# EAGLE board (Eagle)PowerUnit-Bseries(ver2.0) (EAGLE 9.6.2), part 1 of 2
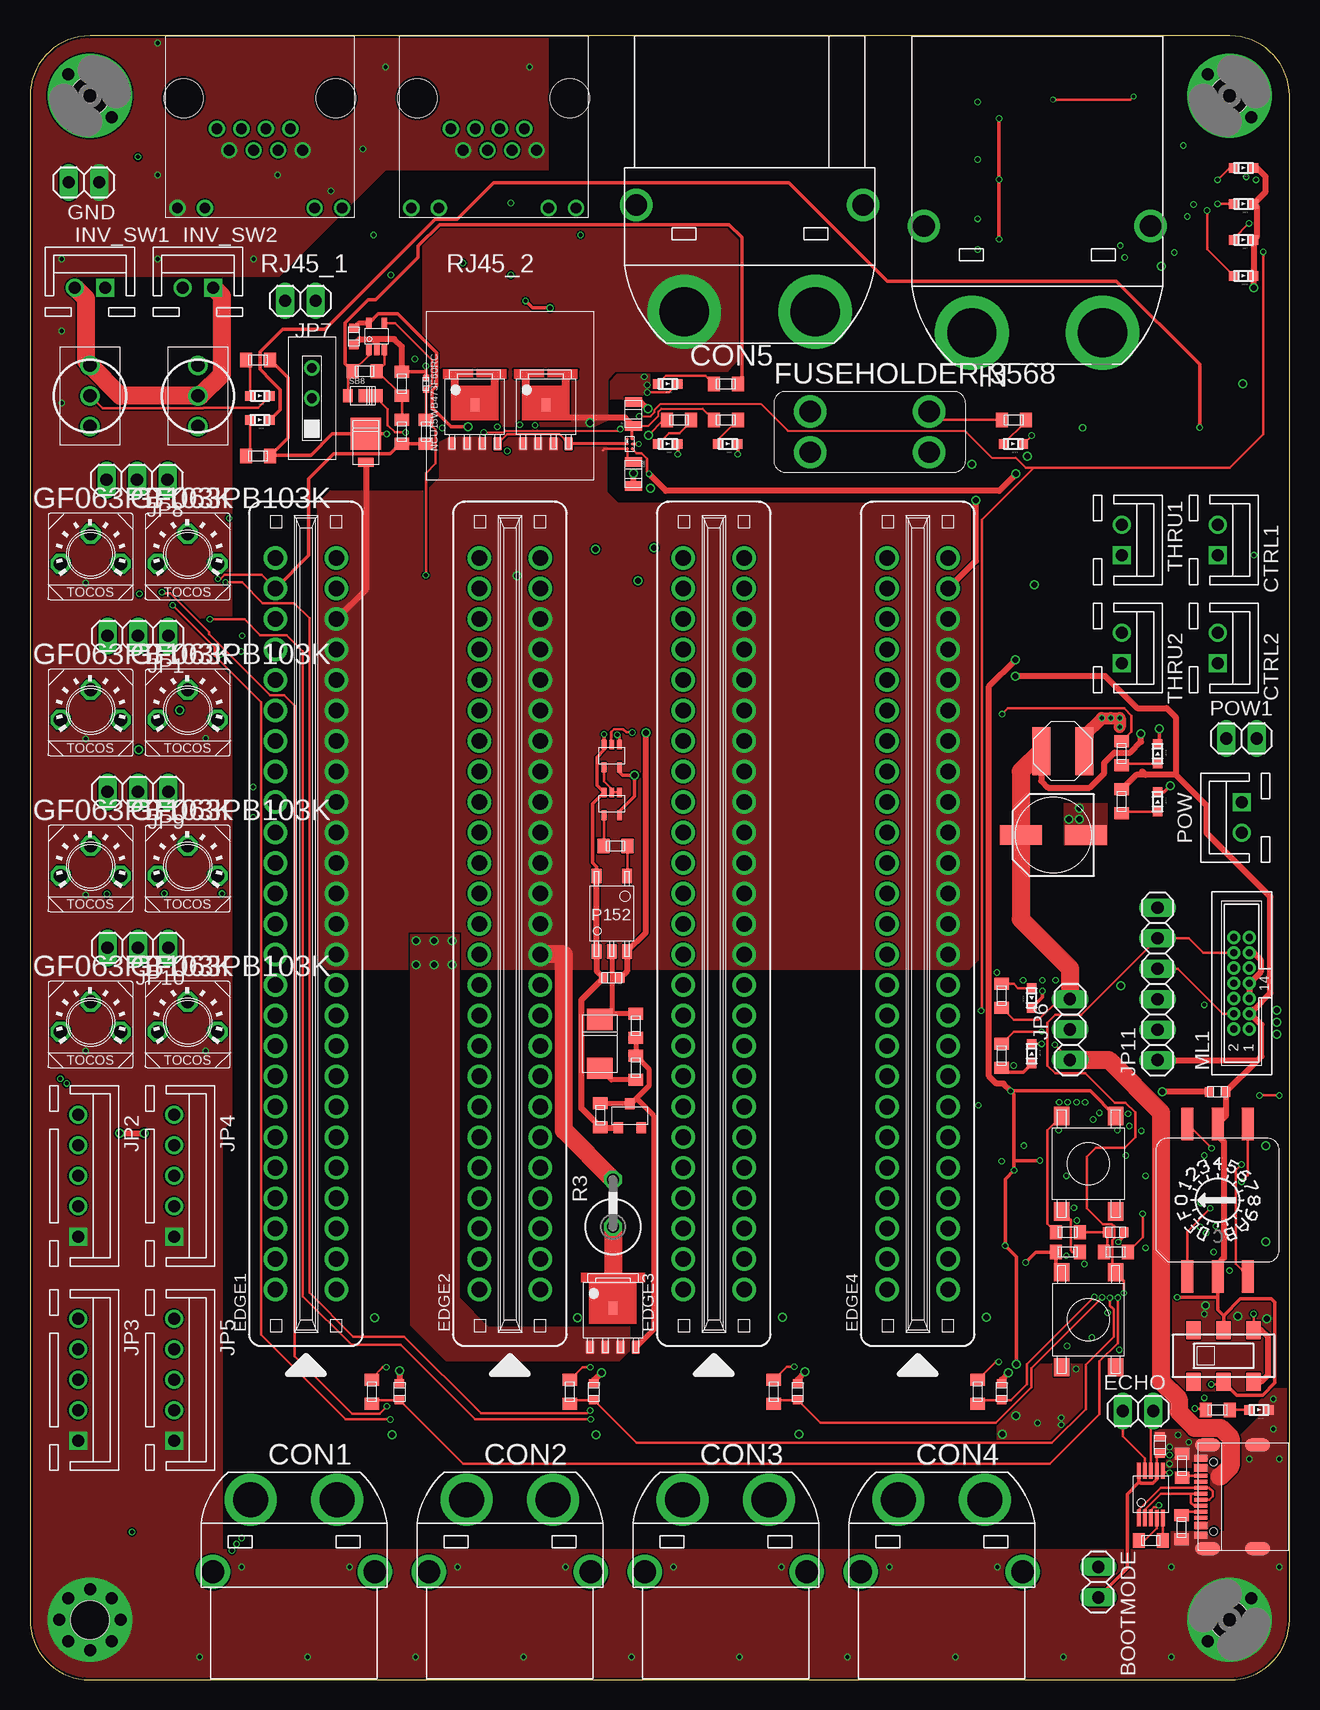
[diagram p4: board, top side]
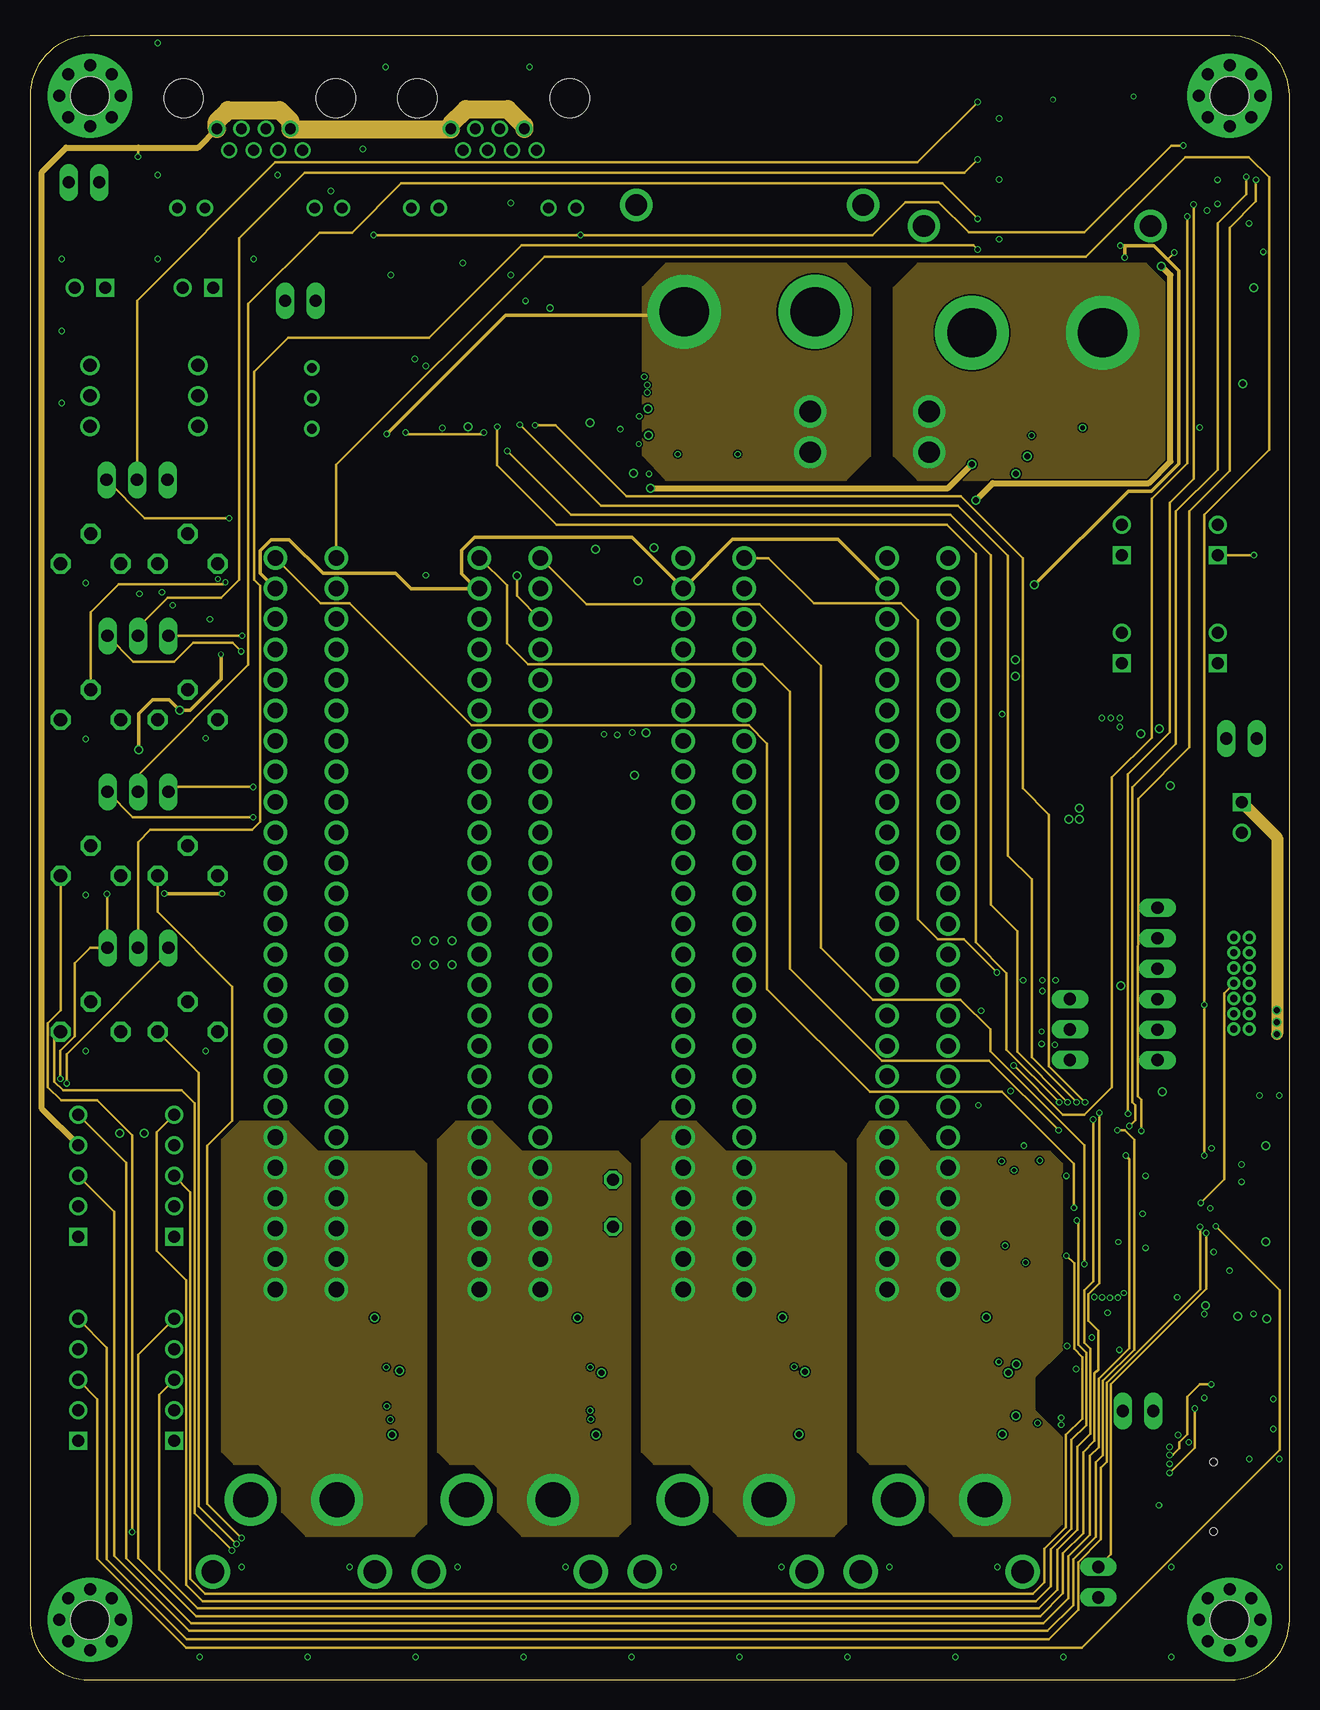
[diagram p5: board, inner layer Route2]
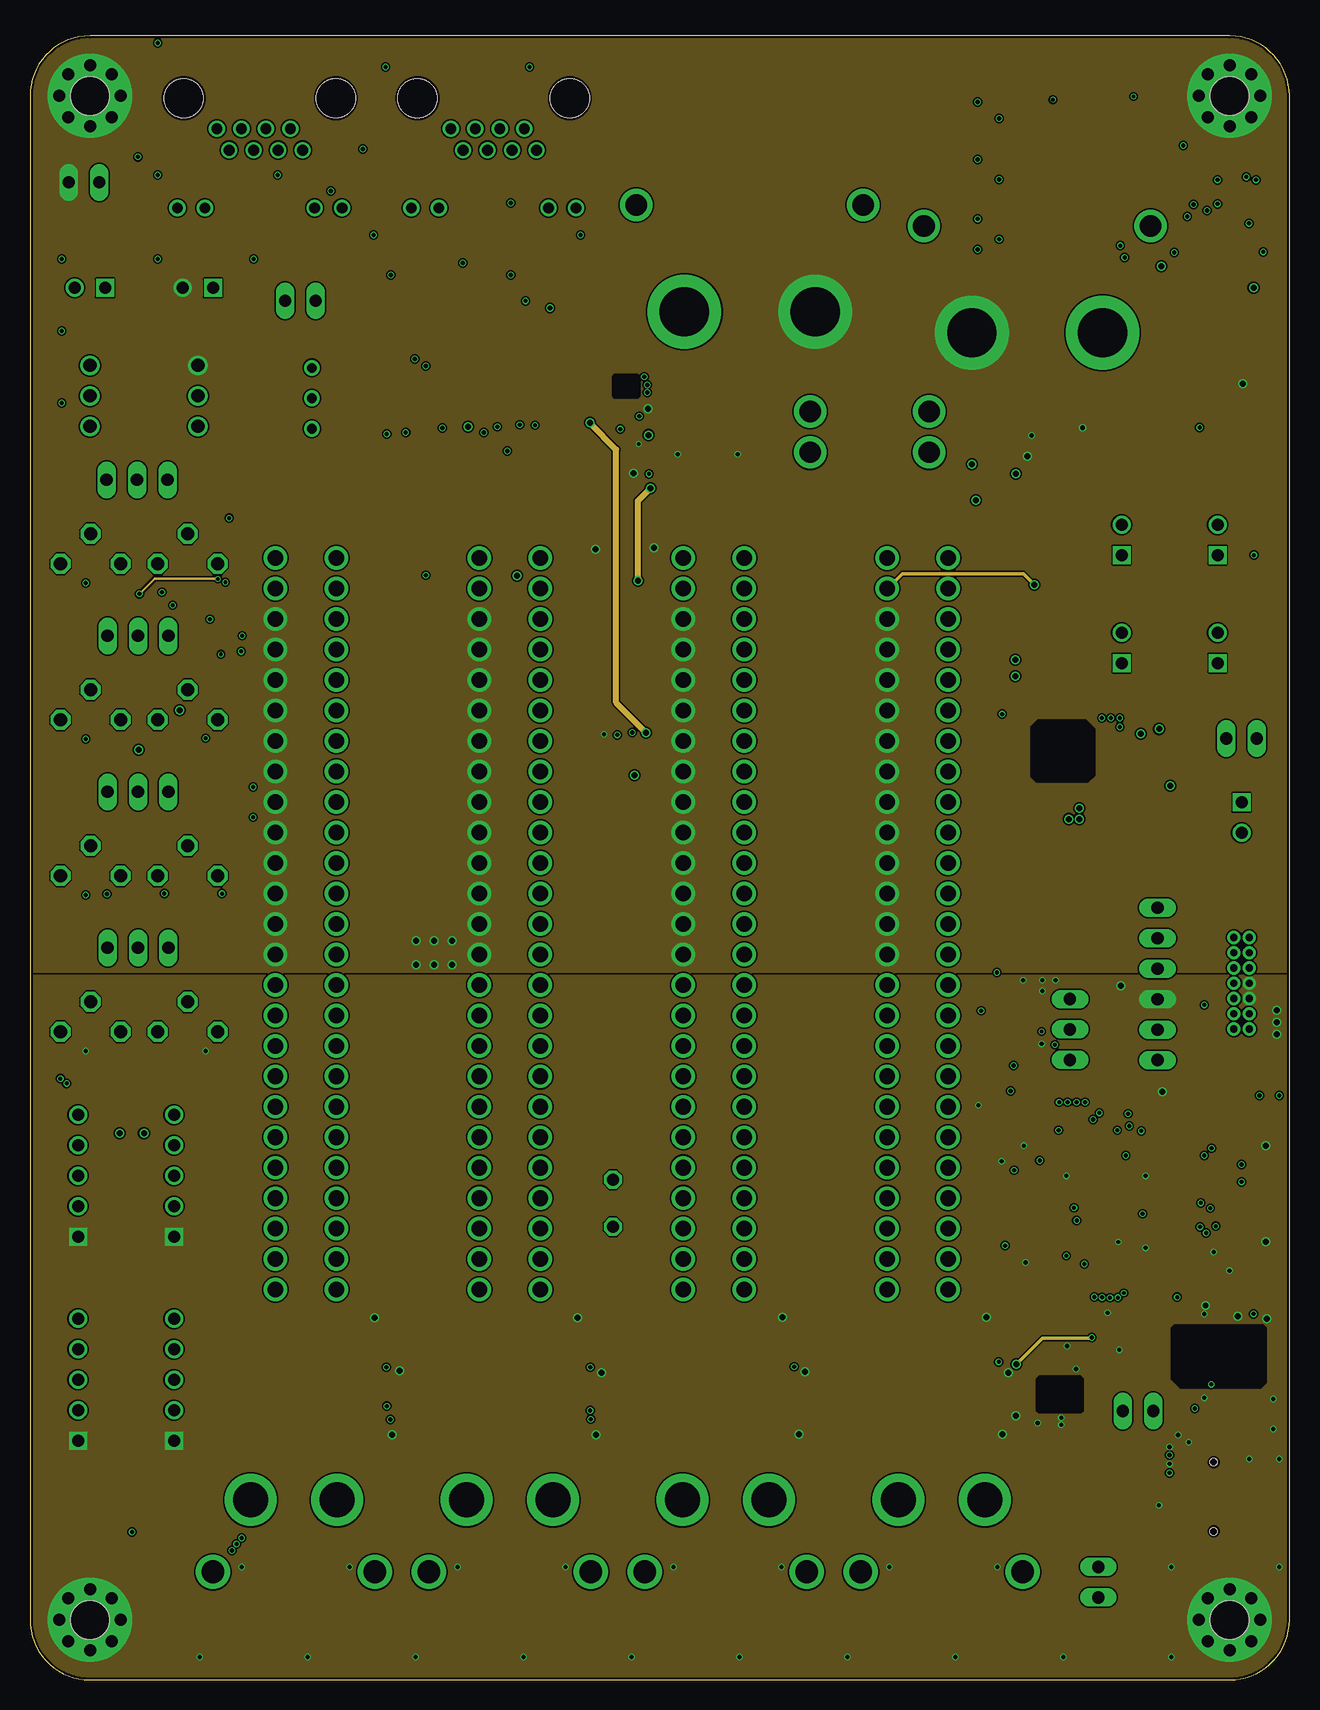
[diagram p6: board, inner layer Route15]
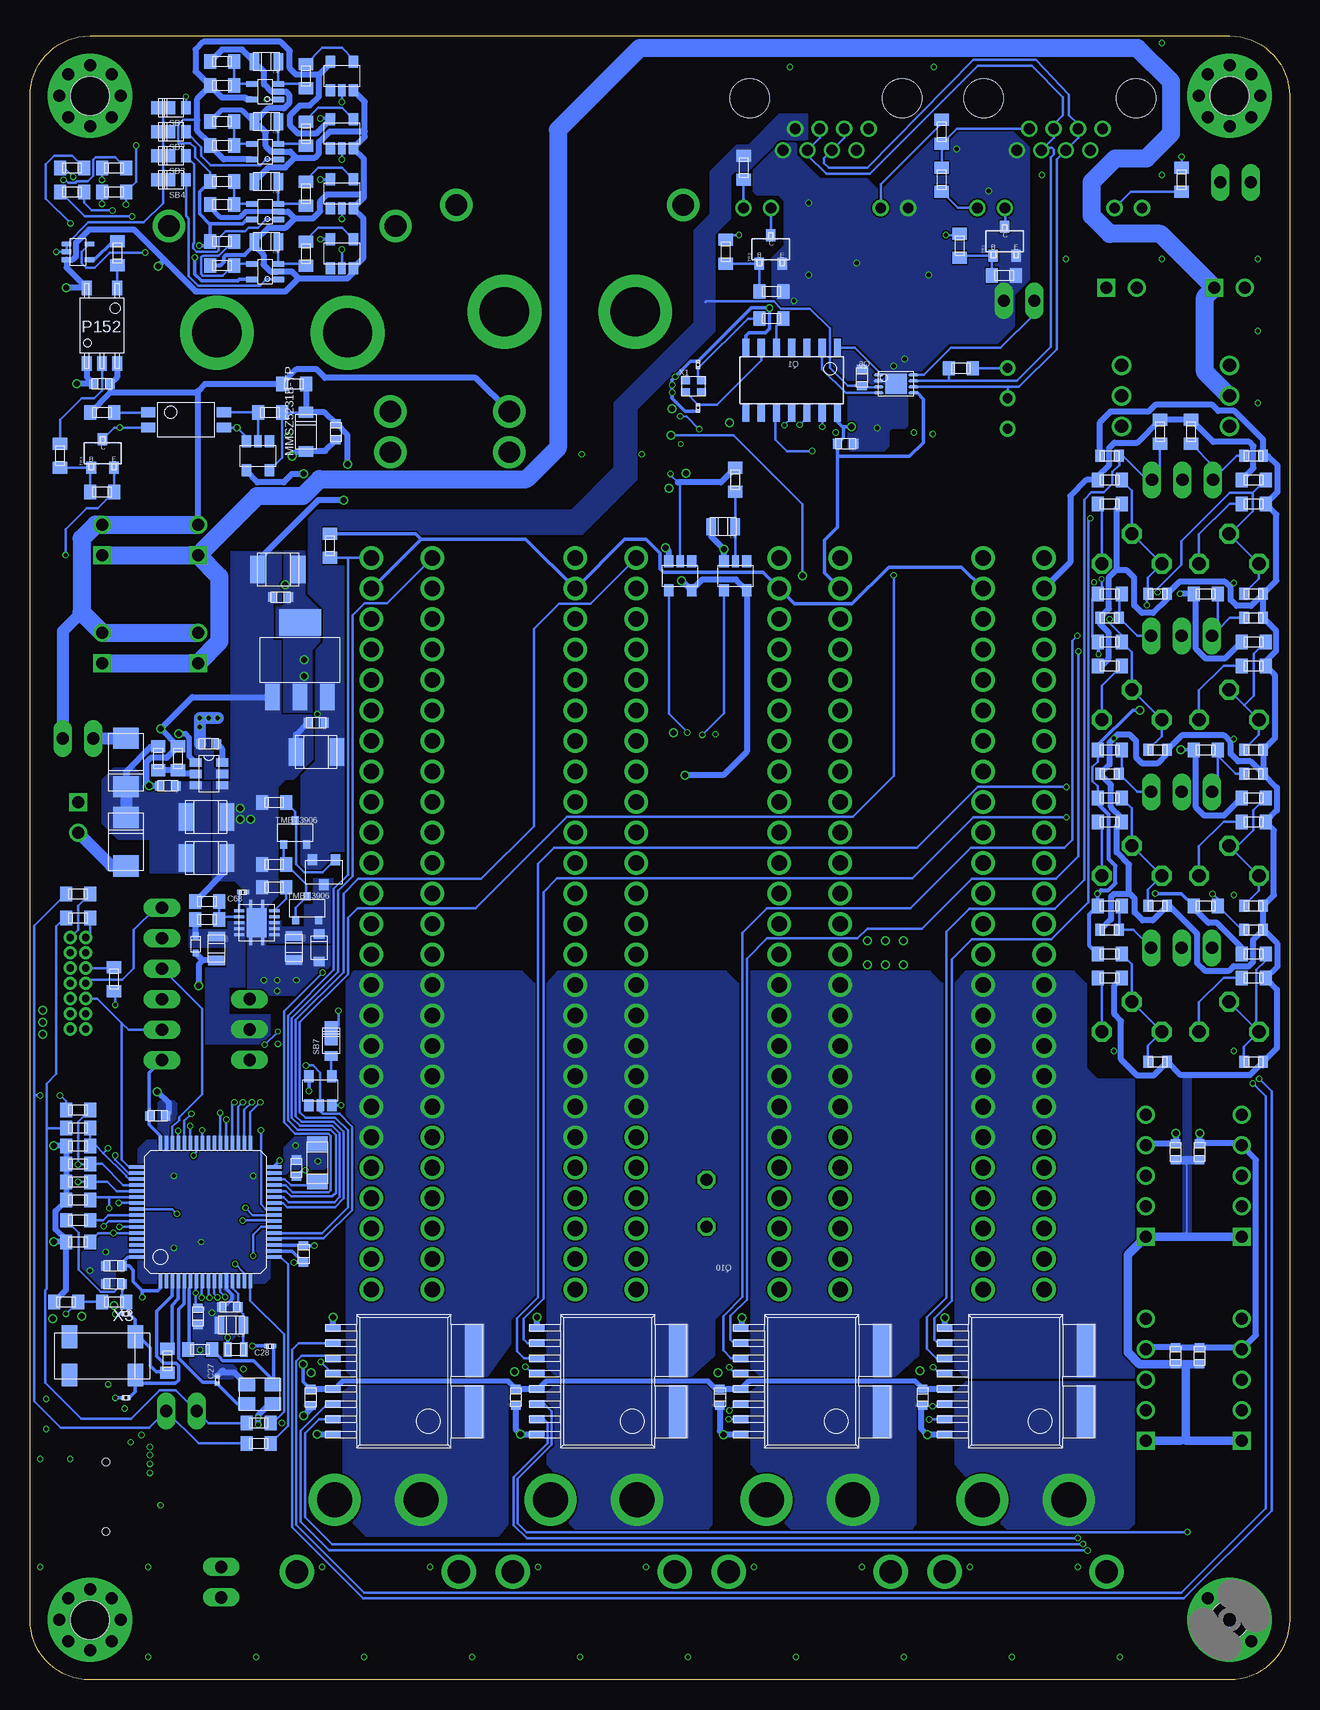
[diagram p7: board, bottom side, seen from below]

Size 105 x 137 mm. Coordinates in mm from the lower left corner, seen from the top.
Outline: 5,0 100,0 arc90 105,5 105,132 arc90 100,137 5,137 arc90 0,132 0,5 arc90 5,0
Copper layers ([2:[15:1+2*15+16]]): Top 0.035559375mm / dielectric 1.6mm / Route2 0.0356mm / dielectric 0.1499mm / Route15 0.0356mm / dielectric 0.2007mm / Bottom 0.035559375mm
Design rules "jlcpcb2layer (1) *": minimum track width 5mil, minimum drill 12mil, track to track 5mil, track to pad 5mil, pad to pad 5mil, via to via 5mil, smd to smd 5mil, copper to edge 8mil, drill to drill 6mil, minimum pad ring 5mil, minimum via ring 3mil, stop-mask expansion 2.5mil, vias tented up to drill 0mil, thermal gap 10mil
tRestrict: 4 lines
bRestrict: area 85.3,42 to 85.6,42.6; 4 lines

## Footprints (pad centres in the part's own frame; a part is rotated, then mirrored left to right if it is on the bottom)
CS11029.5F100 = smd 1.5 x 1.3: 1 -3.95,2.25; 2 3.95,2.25; 3 -3.95,-2.25; 4 3.95,-2.25
PTS645SM95SMTR92LFS = smd 1.55 x 1.3: 1 -3.975,2.25; 2 3.975,2.25; 3 -3.975,-2.25; 4 3.975,-2.25
1X02 = drill 1.016 long: 1 -1.27,0; 2 1.27,0
GRM21BC72A105KE01 = smd 0.8 x 1.4: P$1 -1,0; P$2 1,0
GCM188L81H104KA57 = smd 0.7 x 0.8: P$1 -0.7,0; P$2 0.7,0
GRM32ER71H106KA12 = smd 1.2 x 2.3: L -1.7,0; R 1.7,0
A768EB566M1VLAE042 = smd 3.5 x 1.6: ANODE 2.7,0; CATHODE -2.7,0
3225M = smd 1.2 x 2.3: L -1.7,0; R 1.7,0
GRM0335C1H120GA01 = smd 0.25 x 0.3: 1 -0.275,0; 2 0.275,0
GRM31CR71H475KA12 = smd 1.2 x 1.7: 1 -1.6,0; 2 1.6,0
GRM0335C1E240GA01D = smd 0.35 x 0.4: 1 -0.325,0; 2 0.325,0
GRM18 = smd 0.8 x 1: L -0.8,0; R 0.8,0
XT60PW-F = drill 2.9 pad 4.35: + -3.6,0; - 3.6,0 | drill 1.9 pad 2.85: P$3 -6.75,6; P$4 6.75,6
XT90PW-F = drill 4.1 pad 6.15: + -5.45,0; - 5.45,0 | drill 1.8 pad 2.7: P$3 -9.45,8.9; P$4 9.45,8.9
B2B-XH = drill 1 square: 1 1.27,0 | drill 1: 2 -1.27,0
GS2M-LTP = smd 1.78 x 2.16: A -2.025,0; C 2.025,0
SOD-523 = smd 0.53 x 0.5: A 0.735,0; C -0.735,0
10046971-019LF = drill 1.3: P$1 -30.48,-2.54; P$2 -27.94,-2.54; P$3 -25.4,-2.54; P$4 -22.86,-2.54; P$5 -20.32,-2.54; P$6 -17.78,-2.54; P$7 -15.24,-2.54; P$8 -12.7,-2.54; P$9 -10.16,-2.54; P$10 -7.62,-2.54; P$11 -5.08,-2.54; P$12 -2.54,-2.54; P$13 0,-2.54; P$14 2.54,-2.54; P$15 5.08,-2.54; P$16 7.62,-2.54; P$17 10.16,-2.54; P$18 12.7,-2.54; P$19 15.24,-2.54; P$20 17.78,-2.54; P$21 20.32,-2.54; P$22 22.86,-2.54; P$23 25.4,-2.54; P$24 27.94,-2.54; P$25 30.48,-2.54; P$26 30.48,2.54; P$27 27.94,2.54; P$28 25.4,2.54; P$29 22.86,2.54; P$30 20.32,2.54; P$31 17.78,2.54; P$32 15.24,2.54; P$33 12.7,2.54; P$34 10.16,2.54; P$35 7.62,2.54; P$36 5.08,2.54; P$37 2.54,2.54; P$38 0,2.54; P$39 -2.54,2.54; P$40 -5.08,2.54; P$41 -7.62,2.54; P$42 -10.16,2.54; P$43 -12.7,2.54; P$44 -15.24,2.54; P$45 -17.78,2.54; P$46 -20.32,2.54; P$47 -22.86,2.54; P$48 -25.4,2.54; P$49 -27.94,2.54; P$50 -30.48,2.54
BLM18KG121TN1D = smd 0.65 x 1.2: 1 -0.675,0; 2 0.675,0
FUSEHOLDER-3568 = drill 1.77 pad 2.7: L1 -4.96,1.7; L2 -4.96,-1.7; R1 4.96,1.7; R2 4.96,-1.7
3,2 = drill 3.197 pad 7.01: P$1 0,0 | hole 3.2: 0,0
XT90PW-M = drill 4.1 pad 6.15: + 5.45,0; - -5.45,0 | drill 1.8 pad 2.7: P$3 -9.45,8.9; P$4 9.45,8.9
1X03 = drill 1.016 long: 1 -2.54,0; 2 0,0; 3 2.54,0
B5B-XH = drill 1 square: 1 5.08,0 | drill 1: 2 2.54,0; 3 0,0; 4 -2.54,0; 5 -5.08,0
1X06 = drill 1.016 long: 1 -6.35,0; 2 -3.81,0; 3 -1.27,0; 4 1.27,0; 5 3.81,0; 6 6.35,0
NRS5030T4R7MMGJ = smd 1.5 x 4: L -1.8,0; R 1.8,0
SML-E12V8WT86 = smd 0.8 x 0.8: A 0,1.65; K 0,0
3220-14-0100-00 = drill 0.6 pad 1.1: 1 -3.81,-0.635; 2 -3.81,0.635; 3 -2.54,-0.635; 4 -2.54,0.635; 5 -1.27,-0.635; 6 -1.27,0.635; 7 0,-0.635; 8 0,0.635; 9 1.27,-0.635; 10 1.27,0.635; 11 2.54,-0.635; 12 2.54,0.635; 13 3.81,-0.635; 14 3.81,0.635
NCU15WB473F60RC = smd 0.45 x 0.5: L -0.525,0; R 0.525,0
SQJA16EP-T1_GE3 = smd 0.68 x 1.1: D 0,1.27; G 1.905,-1.99; S1 -1.905,-1.99; S2 -0.635,-1.99; S3 0.635,-1.99
SOT-23F = smd 0.8 x 0.9: D 0,1.05; G -0.95,-1.05; S 0.95,-1.05
TMBT3906 = smd 0.6 x 0.7: B -0.95,-1; C 0,1; E 0.95,-1
CR0603 = smd 1 x 1.2: LEFT -1,0; RIGHT 1,0
0411V = drill 1 pad 1.5 octagon: 1 -2.54,0; 2 1.397,0
MTJ-88ARX1-LH = drill 0.9: 1 9.92,2.54; 2 8.9,4.32; 3 7.88,2.54; 4 6.86,4.32; 5 5.84,2.54; 6 4.82,4.32; 7 3.8,2.54; 8 2.78,4.32; LED1_A -0.51,9.14; LED1_K 1.78,9.14; LED2_A 10.92,9.14; LED2_K 13.21,9.14 | hole 3.25: 0,0; 12.7,0
RSX101VAM-30TR = smd 1.1 x 0.8: A 0,0 | smd 1.1 x 2: C 0,1.9
V2P22LHM3/H = smd 0.762 x 1.27: A 1.175,0 | smd 2.67 x 2.54: C -1.175,0
1SS404,H3F = smd 0.9 x 0.8: A 0,1.15; C 0,-1.15
SS-12SDP2 = drill 0.8 pad 1.3: C 0,0; L -2.54,0; R 2.54,0
RDS-16S-1055-SMT-TR = smd 2.7 x 1: 1 -6.35,2.54; 2 6.35,-2.54; 4 -6.35,-2.54; 8 6.35,2.54; C1 -6.35,0; C2 6.35,0
SSSS213202 = smd 1.2 x 1.5: 1A -2.5,2.15; 1B -2.5,-2.15; 2A 0,2.15; 2B 0,-2.15; 3A 2.5,2.15; 3B 2.5,-2.15
2MS1-T2-B4-M2-Q-E-S = drill 1.09: O 0,-2.54; P 0,0; S 0,2.54
TLP152 = smd 0.8 x 1.2: ANODE -1.27,0; CATHODE 1.27,0; GND 1.27,6.3; VCC -1.27,6.3; VO 0,6.3
GF063PB104K = drill 1.1 octagon: CENTER 3.55,5.5; LEFT 1.05,3; RIGHT 6.05,3
2SC3325 = smd 1 x 0.8: B 0,1.9; C 2.4,0.95; E 0,0
STM32F446XC = smd 0.3 x 1.2: P1 -3.75,-5.75; P2 -3.25,-5.75; P3 -2.75,-5.75; P4 -2.25,-5.75; P5 -1.75,-5.75; P6 -1.25,-5.75; P7 -0.75,-5.75; P8 -0.25,-5.75; P9 0.25,-5.75; P10 0.75,-5.75; P11 1.25,-5.75; P12 1.75,-5.75; P13 2.25,-5.75; P14 2.75,-5.75; P15 3.25,-5.75; P16 3.75,-5.75; P33 3.75,5.75; P34 3.25,5.75; P35 2.75,5.75; P36 2.25,5.75; P37 1.75,5.75; P38 1.25,5.75; P39 0.75,5.75; P40 0.25,5.75; P41 -0.25,5.75; P42 -0.75,5.75; P43 -1.25,5.75; P44 -1.75,5.75; P45 -2.25,5.75; P46 -2.75,5.75; P47 -3.25,5.75; P48 -3.75,5.75 | smd 1.2 x 0.3: P17 5.75,-3.75; P18 5.75,-3.25; P19 5.75,-2.75; P20 5.75,-2.25; P21 5.75,-1.75; P22 5.75,-1.25; P23 5.75,-0.75; P24 5.75,-0.25; P25 5.75,0.25; P26 5.75,0.75; P27 5.75,1.25; P28 5.75,1.75; P29 5.75,2.25; P30 5.75,2.75; P31 5.75,3.25; P32 5.75,3.75; P49 -5.75,3.75; P50 -5.75,3.25; P51 -5.75,2.75; P52 -5.75,2.25; P53 -5.75,1.75; P54 -5.75,1.25; P55 -5.75,0.75; P56 -5.75,0.25; P57 -5.75,-0.25; P58 -5.75,-0.75; P59 -5.75,-1.25; P60 -5.75,-1.75; P61 -5.75,-2.25; P62 -5.75,-2.75; P63 -5.75,-3.25; P64 -5.75,-3.75
MCP2517FD = smd 0.6 x 1.55: CLKO/SOF 2.54,0; INT 3.81,0; INT0/GPIO0 6.35,5.4; INT1/GPIO1 7.62,5.4; NCS 1.27,5.4; OSC1 6.35,0; OSC2 5.08,0; RXCAN 1.27,0; SCK 5.08,5.4; SDI 3.81,5.4; SDO 2.54,5.4; TXCAN 0,0; VDD 0,5.4; VSS 7.62,0
MSOP-10 = smd 0.3 x 1.35: 3V3 -1,1.975; CTS# 1,-1.975; GND 0,-1.975; RTS# 0.5,-1.975; RXD -0.5,1.975; TNOW 1,1.975; TXD 0,1.975; UD+ -1,-1.975; UD- -0.5,-1.975; VCC 0.5,1.975
CZ3A07 = smd 1.59 x 4.44: IN -1.945,3; IP -1.945,8.1 | smd 1.27 x 0.635: OCD1 9.845,2.375; OCD2 9.845,3.645; REF1 9.845,7.455; REF2 9.845,8.725; VDD 9.845,6.185; VOUT 9.845,4.915; VSS1 9.845,1.105; VSS2 9.845,9.995
AP63203WU-7 = smd 0.7 x 1: BST -0.95,1.099; EN 0,-1.099; FB -0.95,-1.099; GND 0.95,1.099; SW 0,1.099; VIN 0.95,-1.099
SC-70-5 = smd 0.45 x 0.95: IN+ -0.65,2.2; IN- -0.65,0; OUT 0.65,2.2; VDD 0.65,0; VSS 0,2.2
TC7S14F = smd 0.8 x 1: GND 0.95,-1.2; NC -0.95,-1.2; OUT 0.95,1.2; VCC -0.95,1.2 | smd 0.6 x 1: IN 0,-1.2
TCK420G = smd 0.23 x 0.23: GND 0.2,0; VCT 0.2,-0.4; VGATE1 -0.2,0.4; VGATE2 -0.2,0; VIN 0.2,0.4; VOUT -0.2,-0.4
WSON10B_TOS-RIC = smd 0.85 x 0.28: DVDT -1.475,1; EFET 1.475,0.5; EN/UVLO -1.475,0.5; ILIM 1.475,1; VIN1 -1.475,0; VIN2 -1.475,-0.5; VIN3 -1.475,-1; VOUT1 1.475,0; VOUT2 1.475,-0.5; VOUT3 1.475,-1 | smd 1.65 x 2.4: GND1 0,0 | smd 0.28 x 0.7: GND2 -0.5,1.55; GND3 0.5,1.55; GND4 -0.5,-1.55; GND5 0.5,-1.55
SSOP5-P-0.65A = smd 0.4 x 0.8: GND 0.65,-0.95; INA 0,-0.95; INB -0.65,-0.95; OUT 0.65,0.95; VCC -0.65,0.95
TLP293 = smd 0.8 x 1.2: ANODE -0.635,-3.15; CATHODE 0.635,-3.15; COLLECTOR -0.635,3.15; EMITTER 0.635,3.15
MCP2558FD = smd 0.25 x 0.85: CANH -0.25,1.45; CANL 0.25,1.45; RXD 0.75,-1.45; S -0.75,1.45; TXD -0.75,-1.45; VDD 0.25,-1.45; VIO 0.75,1.45; VSS -0.25,-1.45 | smd 1.65 x 1.8: EP 0,0
AZ1117C = smd 1.2 x 2.2: GND -2.3,-3.1; INPUT 2.3,-3.1; OUTPUT 0,-3.1 | smd 3.5 x 2.2: VOUT 0,3.1
5077CR-16SMC2-BK-TR = smd 0.3 x 1.1: CC1 -1.25,4.74; CC2 1.75,4.74; DN1 0.25,4.74; DN2 -0.75,4.74; DP1 -0.25,4.74; DP2 0.75,4.74; SBU1 1.25,4.74; SBU2 -1.75,4.74 | smd 0.6 x 1.1: GND1 -3.2,4.74; GND2 3.2,4.74; VBUS1 -2.4,4.74; VBUS2 2.4,4.74 | smd 1.1 x 2.1: SHIELD1 -4.32,4.18; SHIELD2 -4.32,0; SHIELD3 4.32,0; SHIELD4 4.32,4.18 | hole 0.6: -2.89,3.68; 2.89,3.68
XRCGB40M000F4M00R0 = smd 0.75 x 0.7: 1 -0.675,-0.5; 2 0.675,0.5; NC1 -0.675,0.5; NC2 0.675,-0.5
RH100-24.000-18-1020-EXT-TR = smd 1.4 x 1.1: 1 -1.1,-0.8; 2 1.1,-0.8; 3 1.1,0.8; 4 -1.1,0.8
32.768K12.5PI/MC306 = smd 1.3 x 1.9: 1 -2.75,-1.6; 2 2.75,-1.6; 3 2.75,1.6; 4 -2.75,1.6
MMSZ5231B-TP = smd 0.91 x 1.22: ANODE -1.635,0; CATHODE 1.635,0
MMBZ5248B-TP = smd 0.8 x 0.9: ANODE -0.95,-1; CATHODE 0,1; NC 0.95,-1

## Placement (x,y rotation side)
B1  CS11029.5F100  [CS11029.5F100]  88.24,30 270 top
B2  PTS645SM95SMTR92LFS  [PTS645SM95SMTR92LFS]  88.24,43 270 top
BOOTMODE  [1X02]  89.06,8.14 270 top
C2  GRM21BC72A105KE01  [GRM21BC72A105KE01]  50.3,105.5 90 top
C3  GCM188L81H104KA57  [GCM188L81H104KA57]  94.19,19.57 270 top
C4  GRM32ER71H106KA12  [GRM32ER71H106KA12]  90.3,71.9 0 bottom
C5  GRM32ER71H106KA12  [GRM32ER71H106KA12]  90.3,68.5 0 bottom
C6  GCM188L81H104KA57  [GCM188L81H104KA57]  90.1,78 180 bottom
C7  A768EB566M1VLAE042  [A768EB566M1VLAE042]  85.3,70.4 180 top
C8  GCM188L81H104KA57  [GCM188L81H104KA57]  93.5,74.5 180 bottom
C9  GRM32ER71E226KE15  [3225M]  81.13,77.34 180 bottom
C10  GCM188L81H104KA57  [GCM188L81H104KA57]  81.14,79.76 180 bottom
C11  GCM188L81H104KA57  [GCM188L81H104KA57]  84.1,90.23 180 bottom
C12  GRM32ER71E226KE15  [3225M]  84.33,92.54 180 bottom
C13  GCM188L81H104KA57  [GCM188L81H104KA57]  37,103.01 180 bottom
C14  GCM188L81H104KA57  [GCM188L81H104KA57]  35.65,108.53 90 bottom
C15  GCM188L81H104KA57  [GCM188L81H104KA57]  99,49 180 top
C16  GRM0335C1H6R0BA01D  [GRM0335C1H120GA01]  49.3,109.6 90 bottom
C17  GRM0335C1H6R0BA01D  [GRM0335C1H120GA01]  49.3,106 270 bottom
C18  GCM188L81H104KA57  [GCM188L81H104KA57]  82.8,42.65 90 bottom
C19  GCM188L81H104KA57  [GCM188L81H104KA57]  82.2,35.49 270 bottom
C20  GCM188L81H104KA57  [GCM188L81H104KA57]  94.35,47 0 bottom
C21  GCM188L81H104KA57  [GCM188L81H104KA57]  98,34.5 180 bottom
C22  GCM188L81H104KA57  [GCM188L81H104KA57]  88.34,31.08 180 bottom
C23  GRM21BC72A105KE01  [GRM21BC72A105KE01]  88.21,29.56 180 bottom
C24  GRM31CR71H475KA12  [GRM31CR71H475KA12]  81.05,43.09 90 bottom
C26  GCM188L81H104KA57  [GCM188L81H104KA57]  91,30.29 270 bottom
C27  GRM0335C1E240GA01D  [GRM0335C1E240GA01D]  89.4,25 270 bottom
C28  GRM0335C1E240GA01D  [GRM0335C1E240GA01D]  85,27.82 0 bottom
C29  GRM0335C1H150FA01D  [GRM0335C1H120GA01]  97,23.5 0 bottom
C30  GRM0335C1H150FA01D  [GRM0335C1H120GA01]  97,30.5 0 bottom
C31  GCM188L81H104KA57  [GCM188L81H104KA57]  7.5,27 270 bottom
C32  GCM188L81H104KA57  [GCM188L81H104KA57]  7.5,44 270 bottom
C33  GCM188L81H104KA57  [GCM188L81H104KA57]  9.5,44 270 bottom
C34  GCM188L81H104KA57  [GCM188L81H104KA57]  9.5,27 270 bottom
C35  GCM188L81H104KA57  [GCM188L81H104KA57]  90.5,37.3 0 top
C36  GCM188L81H104KA57  [GCM188L81H104KA57]  98,33 180 bottom
C37  GCM188L81H104KA57  [GCM188L81H104KA57]  30.58,23.56 90 bottom
C38  GCM188L81H104KA57  [GCM188L81H104KA57]  47.49,23.56 90 bottom
C39  GRM1885C1H102JA01D  [GRM18]  3,77.5 0 bottom
C40  GRM1885C1H102JA01D  [GRM18]  11,77.5 0 bottom
C41  GRM1885C1H102JA01D  [GRM18]  3,90.5 0 bottom
C42  GRM1885C1H102JA01D  [GRM18]  11,90.5 0 bottom
C43  GCM188L81H104KA57  [GCM188L81H104KA57]  30.8,24 270 top
C44  GRM1885C1H102JA01D  [GRM18]  3,102 0 bottom
C45  GRM1885C1H102JA01D  [GRM18]  15,102 180 bottom
C46  GCM188L81H104KA57  [GCM188L81H104KA57]  47,24 270 top
C47  GRM21BC72A105KE01  [GRM21BC72A105KE01]  85.3,134.85 180 bottom
C48  GRM1885C1H102JA01D  [GRM18]  3,88.5 0 bottom
C49  GRM1885C1H102JA01D  [GRM18]  15,88.5 180 bottom
C50  GRM21BC72A105KE01  [GRM21BC72A105KE01]  85.3,129.85 180 bottom
C51  GRM1885C1H102JA01D  [GRM18]  3,75.5 0 bottom
C52  GRM1885C1H102JA01D  [GRM18]  15,75.5 180 bottom
C53  GRM21BC72A105KE01  [GRM21BC72A105KE01]  85.3,124.85 180 bottom
C54  GRM1885C1H102JA01D  [GRM18]  3,62.5 0 bottom
C55  GRM1885C1H102JA01D  [GRM18]  15,62.5 180 bottom
C56  GRM21BC72A105KE01  [GRM21BC72A105KE01]  85.3,119.85 180 bottom
C57  GCM188L81H104KA57  [GCM188L81H104KA57]  64.5,23.56 90 bottom
C58  GRM1885C1H102JA01D  [GRM18]  3,64.5 0 bottom
C59  GRM1885C1H102JA01D  [GRM18]  11,64.5 0 bottom
C60  GCM188L81H104KA57  [GCM188L81H104KA57]  64,24 270 top
C61  GCM188L81H104KA57  [GCM188L81H104KA57]  81.6,23.54 90 bottom
C62  GRM1885C1H102JA01D  [GRM18]  3,51.5 0 bottom
C63  GRM1885C1H102JA01D  [GRM18]  11,51.5 0 bottom
C64  GCM188L81H104KA57  [GCM188L81H104KA57]  81,24 270 top
C65  GCM188L81H104KA57  [GCM188L81H104KA57]  99,108 180 bottom
C66  GRM21BC72A105KE01  [GRM21BC72A105KE01]  50.3,100.5 270 top
C67  GRM21BC72A105KE01  [GRM21BC72A105KE01]  89.45,60.95 270 bottom
C68  GRM0335C1H620GA01D  [GRM0335C1E240GA01D]  87.25,65.65 0 bottom
C69  GRM21BC72A105KE01  [GRM21BC72A105KE01]  83,61 270 bottom
C70  GCM188L81H104KA57  [GCM188L81H104KA57]  48.5,58.5 180 top
C71  GRM21BC72A105KE01  [GRM21BC72A105KE01]  47.2,96.1 180 bottom
C72  GCM188L81H104KA57  [GCM188L81H104KA57]  27,111.95 270 top
C73  GCM188L81H104KA57  [GCM188L81H104KA57]  79.5,104 270 bottom
CON1  XT60PW-F  [XT60PW-F]  22,15 180 top
CON2  XT60PW-F  [XT60PW-F]  40,15 180 top
CON3  XT60PW-F  [XT60PW-F]  58,15 180 top
CON4  XT60PW-F  [XT60PW-F]  76,15 180 top
CON5  XT90PW-F  [XT90PW-F]  60,114 0 top
CTRL1  02-JST  [B2B-XH]  99,95 270 top
CTRL2  02-JST  [B2B-XH]  99,86 270 top
D1  GS2M-LTP  [GS2M-LTP]  97,76.45 270 bottom
D2  GS2M-LTP  [GS2M-LTP]  97,69.85 90 bottom
D3  PJSD12TS  [SOD-523]  91.2,61.3 270 bottom
D4  GS2M-LTP  [GS2M-LTP]  47.5,53 90 top
ECHO  [1X02]  92.38,22.4 180 top
EDGE1  10046971-019LF-FEMAL  [10046971-019LF]  23,63 90 top
EDGE2  10046971-019LF-FEMAL  [10046971-019LF]  40,63 90 top
EDGE3  10046971-019LF-FEMAL  [10046971-019LF]  57,63 90 top
EDGE4  10046971-019LF-FEMAL  [10046971-019LF]  74,63 90 top
FB1  BLM18KG121TN1D  [BLM18KG121TN1D]  87.85,27.52 0 bottom
FUSE1  FUSEHOLDER-3568  [FUSEHOLDER-3568]  70,104 0 top
GND  [1X02]  4.5,124.79 180 top
H1  MOUNT-HOLE3.2(NORESIST)  [3,2]  5,132 0 top
H2  MOUNT-HOLE3.2(NORESIST)  [3,2]  100,132 0 top
H3  MOUNT-HOLE3.2(NORESIST)  [3,2]  100,5 270 top
H4  MOUNT-HOLE3.2(NORESIST)  [3,2]  5,5 0 bottom
HEATSINK1  V2020B  [V2020B]  40,107 0 top
IN  XT90PW-M  [XT90PW-M]  83.97,112.25 0 top
INV_SW1  02-JST  [B2B-XH]  5,116 0 top
INV_SW2  02-JST  [B2B-XH]  14,116 0 top
JP1  [1X03]  9,87 180 top
JP2  [B5B-XH]  4,42 270 top
JP3  [B5B-XH]  4,25 270 top
JP4  [B5B-XH]  12,42 270 top
JP5  [B5B-XH]  12,25 270 top
JP6  [1X03]  86.7,54.2 90 top
JP7  [1X02]  22.55,114.92 180 top
JP8  [1X03]  8.92,100 180 top
JP9  [1X03]  9,74 180 top
JP10  [1X03]  9,61 180 top
JP11  [1X06]  94,58 90 top
L1  4.7uH  [NRS5030T4R7MMGJ]  86.1,77.4 180 top
LED1  SML-E12V8WT86  [SML-E12V8WT86]  59,103 90 top
LED2  SML-E12V8WT86  [SML-E12V8WT86]  54,103 90 top
LED3  SML-E12V8WT86  [SML-E12V8WT86]  20,107 90 top
LED4  SMLE13BC8T  [SML-E12V8WT86]  103.29,22.5 90 top
LED5  SML-E12V8WT86  [SML-E12V8WT86]  102,126 90 top
LED6  SML-E12V8WT86  [SML-E12V8WT86]  102,123 90 top
LED7  SML-E12V8WT86  [SML-E12V8WT86]  102,120 90 top
LED8  SML-E12V8WT86  [SML-E12V8WT86]  20,105 90 top
LED9  SML-E12V8WT86  [SML-E12V8WT86]  82.8,103 90 top
LED10  SML-E12V8WT86  [SML-E12V8WT86]  54,108 90 top
LED11  SML-E12V8WT86  [SML-E12V8WT86]  83.5,56 0 top
LED12  SML-E12V8WT86  [SML-E12V8WT86]  83.5,53 180 top
LED13  SML-E12V8WT86  [SML-E12V8WT86]  94,78 180 top
LED14  SML-E12V8WT86  [SML-E12V8WT86]  94,74 180 top
LED15  SML-E12V8WT86  [SML-E12V8WT86]  102,117 90 top
ML1  3220-14-0100-00  [3220-14-0100-00]  101,58.05 90 top
NTC1  NCU15WB473F60RC  [NCU15WB473F60RC]  33,108 270 top
POW  02-JST  [B2B-XH]  101,71.85 90 top
POW1  [1X02]  101,78.45 180 top
Q1  SQJA16EP-T1_GE3  [SQJA16EP-T1_GE3]  43,105 0 top
Q2  SSM3J332R  [SOT-23F]  80.5,67.3 180 bottom
Q6  SQJA16EP-T1_GE3  [SQJA16EP-T1_GE3]  37.08,105 0 top
Q10  SQJA16EP-T1_GE3  [SQJA16EP-T1_GE3]  48.6,29.7 0 top
Q11  TMBT3906  [TMBT3906]  82.9,70.6 0 bottom
Q12  TMBT3906  [TMBT3906]  81.9,64.3 0 bottom
R1  11.8k  [CR0603]  3,100 180 bottom
R2  1.1k  [CR0603]  58,105 0 top
R3  10  [0411V]  48.6,40.3 90 top
R4  560  [CR0603]  99,105.6 0 bottom
R5  1.1k  [CR0603]  54.1,105 0 top
R6  820  [CR0603]  50.5,54.5 270 top
R7  120Ω  [CR0603]  27.4,109.3 180 bottom
R8  5.1k  [CR0603]  96.05,17.85 270 top
R9  5.1k  [CR0603]  96,12.7 90 top
R10  150Ω  [CR0603]  99,22.5 180 top
R11  100k  [CR0603]  101,36.5 180 bottom
R12  10k  [CR0603]  84.65,67.95 0 bottom
R13  150  [CR0603]  9,125 90 bottom
R14  0  [CR0603]  43.19,113.44 180 bottom
R15  100k  [CR0603]  80,94.5 270 bottom
R16  0  [CR0603]  85.95,21.4 180 bottom
R17  0  [CR0603]  85.95,19.7 180 bottom
R18  12k  [CR0603]  94.31,76.79 90 bottom
R19  3k  [CR0603]  92.68,76.79 270 bottom
R20  10k  [CR0603]  84.65,73.1 0 bottom
R21  10k  [CR0603]  89,132.85 0 bottom
R22  20k  [CR0603]  89,134.85 180 bottom
R23  1k  [CR0603]  82,133.65 90 bottom
R24  1k  [CR0603]  7,90.5 180 bottom
R25  0  [CR0603]  101,47.5 0 bottom
R26  0  [CR0603]  101,46 0 bottom
R27  0  [CR0603]  90.83,27.52 180 bottom
R28  0  [CR0603]  93.53,26.59 90 bottom
R29  100k  [CR0603]  101,44.5 0 bottom
R30  100k  [CR0603]  101,43 0 bottom
R31  100k  [CR0603]  101,41.5 0 bottom
R32  10  [CR0603]  50.5,51 90 top
R33  1k  [CR0603]  15,90.5 180 bottom
R34  150  [CR0603]  29,129 270 bottom
R35  150  [CR0603]  29,125 270 bottom
R36  150  [CR0603]  45.5,126 270 bottom
R37  10k  [CR0603]  23.8,117.04 180 bottom
R38  10k  [CR0603]  43.2,115.7 180 bottom
R39  5.1k  [CR0603]  27.5,119.5 90 bottom
R40  5.1k  [CR0603]  47,119 90 bottom
R41  100k  [CR0603]  101,40 0 bottom
R42  100  [CR0603]  98,126 0 bottom
R43  100  [CR0603]  98,124 0 bottom
R44  100  [CR0603]  101.5,126 180 bottom
R45  10k  [CR0603]  86.5,35.65 180 top
R46  10k  [CR0603]  86.5,37.3 0 top
R47  1k  [CR0603]  90.5,35.65 0 top
R48  10k  [CR0603]  98,31.5 0 bottom
R49  10k  [CR0603]  102,31.5 180 bottom
R50  1k  [CR0603]  101,38.3 0 bottom
R51  0  [CR0603]  101,65.5 180 bottom
R52  0  [CR0603]  101,63.5 0 bottom
R53  0  [CR0603]  98,58.4 90 bottom
R54  1.2k  [CR0603]  3,98 180 bottom
R55  15.8k  [CR0603]  15,100 180 bottom
R56  1.6k  [CR0603]  15,98 180 bottom
R57  3.3  [CR0603]  28.5,24 90 top
R58  1k  [CR0603]  8.2,104 90 bottom
R59  1k  [CR0603]  10.8,104 90 bottom
R60  10k  [CR0603]  89,127.85 0 bottom
R61  20k  [CR0603]  89,129.85 180 bottom
R62  1k  [CR0603]  82,128.85 90 bottom
R63  1k  [CR0603]  7,77.5 180 bottom
R64  1k  [CR0603]  15,77.5 180 bottom
R65  10k  [CR0603]  89,124.85 0 bottom
R66  20k  [CR0603]  89,122.95 180 bottom
R67  11.8k  [CR0603]  3,86.5 180 bottom
R68  1k  [CR0603]  82,123.85 90 bottom
R69  1k  [CR0603]  7,64.5 180 bottom
R70  1k  [CR0603]  15,64.5 180 bottom
R71  10k  [CR0603]  89,119.85 0 bottom
R72  20k  [CR0603]  89,117.85 180 bottom
R73  1k  [CR0603]  82,118.85 90 bottom
R74  0  [CR0603]  90.25,63.35 180 bottom
R75  ∞  [CR0603]  90.25,64.85 0 bottom
R76  56k  [CR0603]  84.65,66.05 0 bottom
R77  1k  [CR0603]  102.5,102 270 bottom
R78  100  [CR0603]  97.7,118.9 270 bottom
R79  1.1k  [CR0603]  82,105 0 top
R80  33k  [CR0603]  31,104 90 top
R81  1.8k  [CR0603]  31,108 90 top
R82  100k  [CR0603]  33,104 90 top
R83  187k  [CR0603]  27.9,109.05 180 top
R84  0Ω  [CR0603]  93.44,11.6 180 top
R85  100  [CR0603]  58,108 180 top
R86  150  [CR0603]  81,57 270 top
R87  150  [CR0603]  81,52 90 top
R88  100  [CR0603]  91,73.2 90 top
R89  150  [CR0603]  91,77.2 90 top
R90  100  [CR0603]  101.5,124 180 bottom
R95  1.2k  [CR0603]  3,84.5 180 bottom
R96  15.8k  [CR0603]  15,86.5 180 bottom
R97  1.6k  [CR0603]  15,84.5 0 bottom
R98  3.3  [CR0603]  45,24 90 top
R99  11.8k  [CR0603]  3,73.5 180 bottom
R100  1.2k  [CR0603]  3,71.5 180 bottom
R101  15.8k  [CR0603]  15,73.5 180 bottom
R102  1.6k  [CR0603]  15,71.5 180 bottom
R103  3.3  [CR0603]  62,24 90 top
R104  11.8k  [CR0603]  3,60.5 180 bottom
R105  1.2k  [CR0603]  3,58.5 180 bottom
R106  15.8k  [CR0603]  15,60.5 180 bottom
R107  1.6k  [CR0603]  15,58.5 180 bottom
R108  3.3  [CR0603]  79,24 90 top
R113  1.1k  [CR0603]  19,110 180 top
R115  10k  [CR0603]  99,99 180 bottom
R116  1.1k  [CR0603]  19,102 180 top
R119  10k  [CR0603]  47.55,47.05 90 top
R120  1k  [CR0603]  46.2,100 90 bottom
R121  10k  [CR0603]  85,105.6 0 bottom
R122  300  [CR0603]  48.8,69.5 0 top
R123  270  [CR0603]  83,108 180 bottom
RJ45_1  MTJ-88ARX1-LH  [MTJ-88ARX1-LH]  25.5,131.8 180 top
RJ45_2  MTJ-88ARX1-LH  [MTJ-88ARX1-LH]  45,131.8 180 top
SB1  RSX101VAM-30TR  [RSX101VAM-30TR]  92,131 90 bottom
SB2  RSX101VAM-30TR  [RSX101VAM-30TR]  92,129 90 bottom
SB3  RSX101VAM-30TR  [RSX101VAM-30TR]  92,127 90 bottom
SB4  RSX101VAM-30TR  [RSX101VAM-30TR]  92,125 90 bottom
SB5  V2P22LHM3/H  [V2P22LHM3/H]  28,102.65 270 top
SB6  1SS404,H3F  [1SS404,H3F]  80.9,61 180 bottom
SB7  RSX101VAM-30TR  [RSX101VAM-30TR]  79.9,52 0 bottom
SB8  RSX101VAM-30TR  [RSX101VAM-30TR]  26.5,107 270 top
SW1  SS-12SDP2  [SS-12SDP2]  23.5,106.8 90 top
SW2  RDS-16S-1055-SMT-TR  [RDS-16S-1055-SMT-TR]  99,39.98 90 top
SW3  SSSS213202  [SSSS213202]  99.5,27 0 top
SW4  2MS1-T2-B4-M2-Q-E-S  [2MS1-T2-B4-M2-Q-E-S]  5,107 180 top
SW5  2MS1-T2-B4-M2-Q-E-S  [2MS1-T2-B4-M2-Q-E-S]  14,107 180 top
THRU1  02-JST  [B2B-XH]  91,95 270 top
THRU2  02-JST  [B2B-XH]  91,86 270 top
TLP1  TLP152  [TLP152]  99,116 180 bottom
TLP3  TLP152  [TLP152]  48.5,67 180 top
TP1  GF063PB103K  [GF063PB104K]  1.5,90 0 top
TP2  GF063PB103K  [GF063PB104K]  9.6,90 0 top
TP3  GF063PB103K  [GF063PB104K]  1.5,77 0 top
TP4  GF063PB103K  [GF063PB104K]  9.6,77 0 top
TP5  GF063PB103K  [GF063PB104K]  1.5,64 0 top
TP6  GF063PB103K  [GF063PB104K]  9.6,64 0 top
TP7  GF063PB103K  [GF063PB104K]  1.5,51 0 top
TP8  GF063PB103K  [GF063PB104K]  9.6,51 0 top
TR1  2SC3325  [2SC3325]  22.8,118.68 90 bottom
TR2  2SC3325  [2SC3325]  42.3,118 90 bottom
TR3  2SC3325  [2SC3325]  98,101 90 bottom
U1  LQFP64  [STM32F446XC]  90.39,38.99 0 bottom
U2  MCP2517FD  [MCP2517FD]  37.69,111 180 bottom
U3  CH340E  [MSOP-10]  93.44,15.46 0 top
U4  CZ-3A04  [CZ3A07]  18.88,30.44 180 bottom
U5  AP63205WU-7  [AP63203WU-7]  90.09,75.5 270 bottom
U6  CZ-3A04  [CZ3A07]  35.88,30.44 180 bottom
U7  MCP6541T-I/LT  [SC-70-5]  86.5,132.35 270 bottom
U8  CZ-3A04  [CZ3A07]  52.88,30.44 180 bottom
U9  CZ-3A04  [CZ3A07]  69.88,30.44 180 bottom
U10  TC7S14F  [TC7S14F]  79,133.65 0 bottom
U11  MCP6541T-I/LT  [SC-70-5]  86.5,127.35 270 bottom
U12  MCP6541T-I/LT  [SC-70-5]  86.5,122.35 270 bottom
U13  TC7S14F  [TC7S14F]  79,123.85 0 bottom
U14  TCK420G  [TCK420G]  50,103 0 top
U15  TCKE805NAWSON10B_TOS-REC  [WSON10B_TOS-RIC]  86.1,63.1 0 bottom
U16  TC7SH00FULJ  [SSOP5-P-0.65A]  48.5,77 180 top
U17  TC7S14F  [TC7S14F]  46.2,92 180 bottom
U18  TC7S14F  [TC7S14F]  50.8,92 180 bottom
U19  TC7SH00FULJ  [SSOP5-P-0.65A]  48.5,73 180 top
U20  TLP293  [TLP293]  92,105 270 bottom
U21  TC7S14F  [TC7S14F]  86,102 180 bottom
U22  TC7S14F  [TC7S14F]  80.8,49.1 0 bottom
U23  TC7S14F  [TC7S14F]  79,128.85 0 bottom
U24  MCP6541T-I/LT  [SC-70-5]  86.5,117.35 270 bottom
U25  TC7S14F  [TC7S14F]  79,118.85 0 bottom
U26  TC7SH00FULJ  [SSOP5-P-0.65A]  101,119 270 bottom
U27  MCP6541T-I/LT  [SC-70-5]  28.9,113.05 180 top
U$1  MCP2558FD  [MCP2558FD]  32.8,108 270 bottom
U$4  AZ1117CH-3.3TRG1  [AZ1117C]  82.5,85 0 bottom
USB1  5077CR-16SMC2-BK-TR  [5077CR-16SMC2-BK-TR]  102.35,15.26 90 top
X1  XRCGB40M000F4M01R0  [XRCGB40M000F4M00R0]  49.7,107.8 0 bottom
X2  RH100-24.000-18-1020-EXT-TR  [RH100-24.000-18-1020-EXT-TR]  85.85,23.8 0 bottom
X3  32.768K12.5PI/MC306  [32.768K12.5PI/MC306]  98.97,27 180 bottom
ZD1  MMSZ5231B-TP  [MMSZ5231B-TP]  82,104 90 bottom
ZD5  MMBZ5248B-TP  [MMBZ5248B-TP]  50,47 0 top

## Tracks (layer width: path | path; a pad name or v marks a point on that pad's centre or on a via)
5V1  (via drill 0.5)
  Top 0.3: U16.VCC 49.15,75.63 49.38,75.4 v50.4,75.4 50.4,73.62 49.15,72.37 U19.VCC
  Route2 0.5: v51.72,99.31 76.53,99.31 v78.53,101.31
  Route15 0.5: v50.67,91.6 50.67,98.26 v51.72,99.31
  Bottom 0.2: 82.03,105.6 R121.RIGHT 84,101.85 U21.VCC
  Bottom 0.5: R123.LEFT ZD1.CATHODE | 82.03,105.6 ZD1.CATHODE | ZD1.CATHODE 80.44,105.64 C73.P$1 78.53,103.73 v78.53,101.31 | v50.4,75.4 47.2,75.4 45.25,77.35 U17.VCC 46.13,91.68 48.97,91.68 U18.VCC 50.65,91.6 v50.67,91.6
+3V3  (via drill 0.31, 0.35, 0.5)
  Top 0.2: U3.VCC 93.94,18.62 C3.P$2 94.31,18.75 v94.99,18.75 | v98.47,24.63 99.28,24.63 SW3.2B | EDGE1.P$27 19.31,92.09 16.23,92.09 15.89,91.75 v15.66,91.75
  Top 0.3: U3.3V3 92.44,16.56 92.59,16.41 | 92.59,16.41 92.6,16.4 93.62,16.4 93.94,16.71 U3.VCC | BOOTMODE.2 91.48,9.29 91.48,15.49 92.4,16.41 92.59,16.41 | SW3.2B 100.62,23.73 102.75,23.73 103.79,24.77 103.79,31.45 103.49,31.75 100.91,31.75 99.5,30.34 | 99.5,30.34 SW3.2A | SW2.C1 99,31.89 | 99,31.89 99,30.84 99.5,30.34 | R82.LEFT R80.LEFT 30.84,103 30,102.16 25.31,102.16 23.25,100.1 23.25,93.73 EDGE1.P$27 | v80.79,120.05 v80.79,125.03 v80.79,130.12 | v95.64,31.89 99,31.89 | 82.04,43.28 v82.04,42.47 81.3,41.73 v81.3,36.19 82.22,35.27 v82.22,26.3 | 82.04,43.28 82.04,48.79 v81.75,49.08 88.39,49.08 B2.1 | U27.VDD 29.03,113.83 30.65,113.83 33.89,110.59 33.89,107.83 33.53,107.47 33.53,106 | 33.53,106 33.53,105.97 | 33.53,106 35.1,104.42 v36.53,104.42 | v84.18,43.28 82.04,43.28
  Top 0.4: U27.VDD 27.4,113.05 C72.P$1
  Top 0.5: 102.35,51.65 C15.P$1 99.7,47.03 SW2.C2 99,45.38 99.54,44.84 99.54,35.17 99,34.63 SW2.C1 | JP11.1 102.35,51.65 | 102.35,51.65 102.65,51.95 102.65,54.6 101.74,55.51 ML1.3 101.98,55.85 102.02,55.85 103.41,57.25 103.41,65.25 98.1,70.56 98.1,72.85 95.53,75.42 95.51,75.42 | 95.51,75.42 93,75.42 | 93,75.42 92.22,75.42 R88.RIGHT | 93,75.42 92.72,75.71 | v82.15,83.64 89.64,83.64 92.3,80.98 94.76,80.98 95.51,80.23 95.51,75.42 | v81.75,49.08 81.15,49.68 80.58,49.68 79.95,50.31 79.95,82.79 82.15,84.99 v82.15,85
  Route2 0.2: v94.99,18.75 95.27,18.75 95.82,19.3 95.82,19.82 96.48,20.48 96.48,23.58 97.53,24.63 v98.47,24.63 | v95.39,118.94 94.85,118.4 94.83,118.4
  Route2 0.3: EDGE1.P$27 19.19,92.21 19.19,94.09 20.12,95.02 21.61,95.02 24.42,92.21 30.46,92.21 31.76,90.91 37.43,90.91 EDGE2.P$27 37.21,90.94 35.98,92.17 35.98,94.13 37.05,95.2 50.2,95.2 EDGE3.P$27 58.57,95.05 67.35,95.05 EDGE4.P$27 | v83.74,91.25 91.54,99.06 93.48,99.06 95.78,101.36 95.78,117.44 94.83,118.4 93.7,119.52 91.27,119.52 | 91.27,119.52 90.93,119.52 v90.89,119.52 | v12.48,80.81 v12.47,80.81 | v12.47,80.81 11.62,81.66 10.22,81.66 9.05,80.5 v9.05,77.51 v9.05,77.5 | v15.93,85.46 15.93,83.39 13.35,80.81 v12.47,80.81 | v11.2,65.53 v16,65.53 v16.01,65.52 | v91.26,118.53 91.26,119.51 91.27,119.52
  Route15 0.2: v9.13,90.5 10.38,91.75 v15.66,91.75
  Route15 0.3: EDGE4.P$27 72.71,92.19 82.8,92.19 v83.74,91.25 | v82.22,26.3 84.42,28.49 88.48,28.49 v88.52,28.52
  Bottom 0.2: R65.LEFT 90,125.65 91.24,126.89 91.24,127.68 91.63,128.07 92.59,128.07 92.66,128.14 92.66,129.62 92.25,130.03 91.07,130.03 | v90.89,119.52 | 89.96,119.81 R71.LEFT 90.33,119.52 | R101.RIGHT 16,74.48 16.43,74.91 16.43,76.09 16,76.52 R64.RIGHT | R96.RIGHT 16.43,86.93 16.43,90.07 R33.RIGHT 16,90.65 15.66,90.99 v15.66,91.75 | U26.VCC 100.68,119.02 100.68,118.06 100.31,117.69 99.6,117.69 98.35,118.94 v95.39,118.94 | 79.97,125.03 U13.VCC
  Bottom 0.3: U1.P64 96.86,35.24 97.3,34.8 C21.P$1 96.74,34.5 96.39,34.15 96.39,33.18 95.64,32.43 | JP11.1 95.05,50.6 C20.P$1 95.05,46.25 94.14,45.34 U1.P48 | U12.VDD 86.93,121.7 87.27,121.36 90.05,121.36 | 90.05,121.36 90.85,122.16 90.85,124 R65.LEFT | 91.07,130.03 91.05,130.01 | U2.VDD 37.69,104.85 37.26,104.42 | 37.26,104.42 37.2,104.36 37.2,103.51 C13.P$2 37.7,101.95 | 37.7,101.95 37.7,96.06 38.77,94.99 38.77,92.25 EDGE2.P$27 | 90.05,121.36 90,121.31 R71.LEFT | v90.89,119.52 90.33,119.52 | U1.P19 82.25,36.24 C19.P$1 v81.3,36.19 | U1.P1 94.14,32.64 94.35,32.43 95.64,32.43 | R64.RIGHT 15.97,77.53 15.97,77.91 13.07,80.81 v12.48,80.81 | v9.05,77.5 v9.04,77.5 R63.RIGHT | R96.RIGHT 15.93,86.43 v15.93,85.47 v15.93,85.46 | U25.VCC v80.79,120.05 | v80.79,125.03 79.97,125.03 | v80.79,130.12 80.02,130.12 U23.VCC | 95.64,32.43 v95.64,31.89 | C18.P$1 82.28,42.47 v82.04,42.47 | v81.75,49.08 U22.VCC | U$1.VIO 31.04,107.25 30.53,106.74 30.53,103.11 31.69,101.95 37.7,101.95 | v36.53,104.42 37.26,104.42 | C61.P$2 82.22,24.86 v82.22,26.3 | U1.P32 84.64,42.82 v84.18,43.28 | v88.52,28.52 FB1.1 | R69.RIGHT 9.03,65.53 v11.2,65.53 | U24.VDD 87.55,116.7 87.65,116.6 90.7,116.6 91.26,117.15 v91.26,118.53
  Bottom 0.35: R101.RIGHT 16,73.28 15.98,73.26 16.23,73.26 15.08,72.1 15.08,68.39 14.52,67.83 14.52,66.4 15.11,65.81 15.73,65.81 v16.01,65.52 R70.RIGHT 16.72,63.78 16.72,61.22 R106.RIGHT
  Bottom 0.4: C37.P$2 31.21,24.89 44.95,24.89 44.95,24.88 45.11,24.88 U6.VDD | C38.P$2 47.85,24.26 48.48,24.89 61.96,24.89 62.59,24.25 U8.VDD | C57.P$2 65.14,24.89 78.94,24.89 79.58,24.25 U9.VDD
  Bottom 0.5: U23.VCC 81.15,128.85 82.65,128.85 83.3,129.5 83.3,130.4 82.5,131.2 81.65,131.2 80.92,131.93 80.92,133.77 | U10.VCC 79.95,134.74 80.92,133.77 | 80.92,133.77 82.82,133.77 83.35,134.3 83.35,135.75 84.1,136.5 90.55,136.5 91.2,135.85 91.2,134.05 R21.LEFT 89.97,132.82 | U7.VDD 86.9,131.7 87.05,131.85 89,131.85 89.97,132.82 | U11.VDD 88.85,126.7 R60.LEFT 90,128.05 91.05,129.1 91.05,130.01 91.05,131.75 89.97,132.82 | C37.P$2 U4.VDD | C38.P$2 U6.VDD | C57.P$2 U8.VDD | C61.P$2 81.59,24.25 U9.VDD | R1.RIGHT 3.02,100.98 3.02,102.82 3.36,103.17 6.37,103.17 R58.RIGHT R59.RIGHT 12.7,103.1 14.59,103.1 15.02,102.67 15.02,101.24 16.02,100.24 16.02,100.17 16,100.16 R55.RIGHT | R55.RIGHT 15.97,100.03 | R67.RIGHT 5.4,85.1 6.97,85.1 7.8,85.93 7.8,90.3 R24.RIGHT v9.13,90.5 | R99.RIGHT 5.47,72.03 7.1,72.03 7.8,72.73 7.8,77.3 R63.RIGHT | R55.RIGHT 16.92,100 18.28,98.64 18.28,93.12 EDGE1.P$27 | R104.RIGHT 4,61.02 6.06,63.08 6.76,63.08 8,64.32 R69.RIGHT
  pour Bottom (no thermals): 81.45,80.65 81.45,85.9 80.8,86.55 80.8,89.15 82.05,90.4 82.05,94.05 83.85,94.05 83.85,89.45 84.55,89.45 84.55,86.85 83.9,86.85 83.9,80.65
+5V  (via drill 0.35, 0.5)
  Top 0.2: R89.RIGHT 91.82,79.02 91.82,80.35 91.21,80.96 81.52,80.96 v81.04,80.48
  Top 0.5: v7.49,45.57 v9.5,45.57
  Route2 0.2: v9,126.92 9,127.65 9.03,127.68
  Route2 0.5: JP2.4 4,44.58 0.98,47.6 0.98,125.65 3.01,127.68 9.03,127.68 14,127.68 RJ45_1.1
  Route2 1.5: RJ45_1.1 15.58,129.88 16.51,130.81 20.8,130.81 21.7,129.91 RJ45_1.7 21.7,129.2 35.08,129.2 RJ45_2.1 35.08,129.63 36.35,130.9 39.81,130.9 41.2,129.51 RJ45_2.7
  Bottom 0.2: U$1.VDD 34.27,107.73 35.55,107.73 C14.P$1 36.81,107.83 38.33,109.34 38.33,112.63 39.97,114.27 42.4,114.27 42.99,114.87 48.65,114.87 48.7,114.81 | RJ45_1.7 27.74,129.26 R34.RIGHT R35.LEFT | R13.RIGHT v9,126.92
  Bottom 0.5: JP4.4 11.84,44.7 C33.P$1 v9.5,45.57 | JP5.4 11.84,27.7 C34.P$1 C31.P$1 4.16,27.7 JP3.4 2.8,28.74 2.8,43.34 JP2.4 4.16,44.7 C32.P$1 v7.5,45.56 v7.49,45.57
  Bottom 1: U$4.INPUT 80.15,81.85
  pour Bottom (no thermals): 81.2,83.05 78.8,83.05 78.8,69 80,69 80,67.9 80.6,67.3 82.1,67.3 82.4,67.6 82.4,75.35 81.2,76.55
  pour Bottom (no thermals): 78.8,82.85 78.8,92.8 80.5,92.8 80.75,93.05 80.75,95.49 58.93,95.49 54.35,100.07 54.35,105.92 47.85,112.42 47.85,120.5 46.55,121.8 46.55,125.4 46.25,125.7 45.15,125.7 42.5,128.35 40.15,128.35 40.15,130.45 42.55,130.45 45.1,127.9 46.1,127.9 48.35,125.65 48.35,122.1 49.7,120.75 49.7,113.05 56.35,106.4 56.35,101 59.86,97.49 81.1,97.49 81.82,96.77 81.82,90.52 80.55,89.25 80.55,86.45 81.2,85.8 81.2,82.85
ALIVE_LED  (via drill 0.35)
  Route2 0.2: v102.2,125 102.2,123.2 100,121 100,100.75 96.65,97.4 96.65,77.7 92.39,73.44 92.35,49 | 92.35,49 92.35,48.7 | 92.35,49 92.35,48.65 92.65,48.35 v92.65,45.75
  Bottom 0.2: R42.RIGHT 97.9,126.9 99.52,126.9 99.73,126.69 99.73,125.35 100.21,124.87 101.08,124.87 101.2,124.76 101.8,124.76 102.04,125 v102.2,125 | v92.65,45.75 U1.P45
BOOT0  (via drill 0.35)
  Route2 0.2: v98.05,37.24 98.05,32.58 90.1,24.63 90.1,10.45 BOOTMODE.1
  Bottom 0.2: U1.P60 v98.05,37.24 99.31,37.24 100,36.55 R11.LEFT
CAN_H
  Bottom 0.2: U$1.CANH 28.4,108.25 | 28.4,108.25 22.75,108.25 19.91,111.09 19.91,126.88 19.66,127.13 19.66,127.52 19.83,127.69 20.11,127.69 20.32,127.48 RJ45_1.6 19.66,128.5 RJ45_1.5 | RJ45_1.5 19.66,129.62 | RJ45_1.5 19.66,129.64 18.9,130.4 18.9,131.9 21.5,134.5 26,134.5 35,125.5 38.61,125.5 40.18,127.07 RJ45_2.6 39.16,128.5 RJ45_2.5 | R7.RIGHT 28.4,108.25
CAN_L
  Bottom 0.2: U$1.CANL 23.5,107.75 | 23.5,107.75 22.54,107.75 19.41,110.88 19.41,126.71 RJ45_1.4 17.62,128.5 RJ45_1.3 17.62,129.62 18.4,130.4 18.4,132.11 21.15,135 26.35,135 35.21,126 38.4,126 38.8,126.4 38.8,126.82 RJ45_2.4 37.12,128.5 RJ45_2.3 | SW1.C 23.5,107.75
COM_LED  (via drill 0.35)
  Route2 0.2: v91.54,47.18 91.54,75.49 95,78.95 95,98.1 97,100.1 v97,122.95 | v28.65,120.4 v45.9,120.4 70.23,120.4 72.99,123.16 75.75,123.16 78.28,120.63 87.89,120.63 95.13,127.86 v96.14,127.86
  Bottom 0.2: U1.P44 92.14,46.58 v91.54,47.18 | v97,122.95 R43.RIGHT 96.14,124.86 v96.14,127.86 | 27.9,120.1 R39.RIGHT 27.5,120.4 v28.65,120.4 | v45.9,120.4 46.6,120.4 R40.RIGHT
CS  (via drill 0.35)
  Route2 0.2: v38.95,104.43 38.95,101.2 43.9,96.25 76.45,96.25 78.85,93.85 78.85,61.45 81.41,58.89 81.41,52.53 v85.8,48.14
  Bottom 0.2: U1.P33 86.64,47.3 v85.8,48.14 | v38.95,104.43 U2.NCS
CS1_OCD1  (via drill 0.35)
  Route2 0.2: v16.61,96.81 9.57,96.81 JP8.3
  Bottom 0.2: JP8.3 4.38,102 C44.L | R58.LEFT 6.38,101.18 JP8.3 | JP8.3 6.4,100 | U4.OCD1 28.81,28.15 29.4,28.15 29.6,28.35 29.6,30.15 28.15,31.6 28.15,60.05 26.5,61.7 19.87,61.7 16.78,64.79 16.78,96.61 16.61,96.79 v16.61,96.81
CS1_OCD2
  Bottom 0.2: R59.LEFT 10.8,100.66 JP8.1 11.9,100 13.9,102 C45.L 14.2,101.23 14.75,100.67 14.75,99.7 15.48,98.97 16.5,98.97 17.11,98.35 17.11,66.69 19.55,64.25 26.7,64.25 28.6,62.35 28.6,31.85 30.25,30.2 30.25,27.6 29.45,26.8 U4.OCD2
CS1_REF1  (via drill 0.35)
  Top 0.2: v29.75,22.81 29.13,22.19 26.84,22.19 22.07,26.95 22.07,81.17 21.19,82.05 20,82.05 14.92,87.13 14.92,87.29 11.67,90.54 11.09,90.54 v11,90.63
  Bottom 0.2: C41.L 2.55,91.75 TP1.LEFT TP1.CENTER 4.95,95.5 3.07,97.38 3.07,98.93 | U4.REF1 28.9,22.81 v29.75,22.81 | v11,90.63 11,90.95 9.02,92.93 9.02,94.89 4.98,98.93 3.07,98.93 | 3.07,98.93 R1.LEFT
CS1_REF2  (via drill 0.35)
  Top 0.2: v30.05,21.7 26.3,21.7 19.25,28.75 19.25,81.49 15.39,85.35 15.39,86.06 v11.9,89.55
  Bottom 0.2: v11.9,89.55 11.9,90.39 C42.L 11.8,91.85 TP2.LEFT TP2.CENTER 13.15,99.1 14,99.95 R55.LEFT | v30.05,21.7 28.74,21.7 U4.REF2
CS2_OCD1  (via drill 0.35)
  Route2 0.2: v17.61,85.71 v17.61,85.72 16.88,86.45 13.61,86.45 12.01,84.85 8.61,84.85 JP1.3
  Bottom 0.2: JP1.3 6,87.46 | 6,87.46 4.96,88.5 C48.L | R24.LEFT 6,87.46 | U6.OCD1 46.28,28.07 46.3,28.05 46.59,28.34 46.59,30.35 45.25,31.68 45.25,60.1 43.55,61.8 36,61.8 35.2,62.6 30.65,62.6 26.5,66.75 19.5,66.75 17.61,68.64 17.61,85.61 v17.61,85.71
CS2_OCD2  (via drill 0.35)
  Route2 0.2: v17.69,87 JP1.1
  Bottom 0.2: R33.LEFT 14.2,90.3 C49.L 12.7,87 JP1.1 | U6.OCD2 46.55,26.8 47.2,27.45 47.2,30.31 45.6,31.91 45.6,62.25 43.55,64.3 31.6,64.3 26.55,69.35 18.79,69.35 18.11,70.03 18.11,86.58 v17.69,87
CS2_REF1  (via drill 0.31, 0.35)
  Top 0.2: v46.7,22.45 46.45,22.2 37.6,22.2 31.2,28.6 26.96,28.6 23.29,32.26 23.29,88.47 22.02,89.74 19.41,89.74 17.68,91.47 v16.29,91.47
  Route2 0.2: v16.29,91.47 16.11,91.28 7.38,91.28 5.05,88.95 TP3.CENTER
  Bottom 0.2: TP3.CENTER 3.77,81.22 | 3.77,81.22 TP3.LEFT 2.55,78.75 C39.L | 3.77,81.22 3,82 3,85.5 R67.LEFT | U6.REF1 46.16,22.98 v46.7,22.45
CS2_REF2  (via drill 0.35)
  Top 0.2: v15,88.39 17.89,88.39 19.21,87.07 21.39,87.07 22.75,85.72 22.75,31.99 26.82,27.92 30.9,27.92 37.1,21.71 v46.76,21.71
  Bottom 0.2: C40.L 10.65,78.65 TP4.LEFT TP4.CENTER 13.15,85.65 R96.LEFT 14,87.07 15,88.07 v15,88.39 | v46.76,21.71 U6.REF2
CS3_OCD1  (via drill 0.35)
  Route2 0.2: v18.6,71.89 8.57,71.89 JP9.3
  Bottom 0.2: JP9.3 6,74.46 R63.LEFT 6,77 4.5,75.5 C51.L | U8.OCD1 63.52,28.07 63.85,28.4 63.85,30.1 62.2,31.75 62.2,65.65 61.05,66.8 31.45,66.8 26.36,71.89 v18.6,71.89
CS3_OCD2  (via drill 0.35)
  Route2 0.2: v18.6,74.41 11.95,74.41 JP9.1
  Bottom 0.2: R64.LEFT 14,75.5 C52.L 12.7,74 JP9.1 | U8.OCD2 63.8,26.8 64.4,27.4 64.4,30.15 62.65,31.9 62.65,68 61.31,69.34 31.06,69.34 25.99,74.41 v18.6,74.41
CS3_REF1  (via drill 0.35)
  Route2 0.2: TP5.LEFT 2.55,55.8 1.49,54.74 1.49,49.4 2.58,48.31 5.61,48.31 8.51,45.4 v8.51,12.32
  Bottom 0.2: C58.L 2.55,65.75 TP5.LEFT TP5.CENTER 4.3,69.5 3.02,70.79 3.02,72.48 R99.LEFT | U8.REF1 62.09,22.98 61.51,22.41 61.51,19.58 64.34,16.76 64.34,13.03 63.61,12.3 17.85,12.3 17.84,12.31 v8.52,12.31 v8.51,12.32
CS3_REF2  (via drill 0.35)
  Route2 0.2: TP6.LEFT 10.65,64 16.87,57.78 16.87,46.61 14.79,44.53 14.79,14.68 v17.64,11.82
  Bottom 0.2: R101.LEFT 13.15,72.65 TP6.CENTER TP6.LEFT 11.8,65.85 C59.L | U8.REF2 62.13,21.71 61.84,21.42 61.84,19.72 64.67,16.89 64.67,12.9 63.58,11.81 18.05,11.81 v17.65,11.81 v17.64,11.82
CS4_OCD1  (via drill 0.35)
  Route2 0.2: v6.42,65.5 6.42,65.52 6.42,61.04 JP10.3 5,61 3.72,59.72 3.72,53.63 2.53,52.44 v2.53,50.1
  Bottom 0.2: C54.L 4,62.5 R69.LEFT 6,65.08 v6.42,65.5 | U9.OCD1 82.61,28.07 83.16,27.51 83.16,12.71 77.24,6.79 8.81,6.79 1.5,14.1 1.5,49.07 v2.53,50.1
CS4_OCD2  (via drill 0.35)
  Route2 0.2: v3.06,49.71 3.06,52.15 11.86,60.95 11.49,60.95 JP10.1
  Bottom 0.2: 14,62.5 C55.L | C55.L 13,62.5 11.54,61.04 JP10.1 | R70.LEFT 14.2,64.3 C55.L | U9.OCD2 79.93,27 82.38,27 82.83,26.55 82.83,12.93 77.15,7.25 9.04,7.25 2,14.28 2,48.65 v3.06,49.71
CS4_REF1  (via drill 0.35)
  Route2 0.2: v16.84,10.78 13.73,13.89 13.73,48.05 12.66,49.12 2.77,49.12 2.03,49.86 2.03,53.48 TP7.LEFT
  Bottom 0.2: TP7.CENTER 2.77,54.22 | 2.77,54.22 TP7.LEFT 3.8,52.75 C62.L | R104.LEFT 2,59.94 2.77,59.17 2.77,54.22 | U9.REF1 80.23,22.98 82.44,20.77 82.44,13.18 80.05,10.78 v16.84,10.78
CS4_REF2  (via drill 0.35)
  Route2 0.2: v17.22,11.32 14.06,14.48 14.06,50.59 TP8.LEFT
  Bottom 0.2: R106.LEFT 13.15,59.65 TP8.CENTER TP8.LEFT 11.8,52.85 C63.L | U9.REF2 80.88,21.71 82.04,20.55 82.04,13.54 79.83,11.32 v17.22,11.32
CURRENT1  (via drill 0.35)
  Top 0.2: R57.LEFT 28.8,23.3 C43.P$2 36.1,18 85,18 89.15,22.15 89.15,26.54 90.68,28.07 v90.69,31.85
  Bottom 0.2: v90.69,31.85 v90.69,31.86 90.67,33.21 U1.P8
CURRENT2  (via drill 0.35)
  Top 0.2: v90.03,31.84 90.03,31.18 90.34,30.87 90.33,28.59 88,26.25 88,22.55 85.2,19.75 50.55,19.75 C46.P$2 45.3,23.3 R98.LEFT
  Bottom 0.2: U1.P9 90.1,33.2 90.1,32.15 90.03,32.08 v90.03,31.84
CURRENT3  (via drill 0.35)
  Top 0.2: v89.38,31.88 v89.39,31.88 83.47,25.96 83.47,24.37 80.51,21.41 65.89,21.41 C60.P$2 62.3,23.3 R103.LEFT
  Bottom 0.2: U1.P10 89.64,32.17 89.38,31.94 v89.38,31.88
CURRENT4  (via drill 0.35)
  Top 0.2: v88.72,31.91 v88.72,31.92 83.09,26.29 83.09,24.64 81.75,23.3 C64.P$2 79.3,23.3 R108.LEFT
  Bottom 0.2: U1.P11 89.15,32.35 88.72,31.93 v88.72,31.91
DEBUG_BT  (via drill 0.35)
  Top 0.2: v92.75,38.85 92.75,36.9 R47.RIGHT
  Bottom 0.2: U1.P56 93.14,39.24 v92.75,38.85
DEBUG_LED  (via drill 0.35)
  Route2 0.2: v101.4,125.25 101.4,123.8 99,121.4 99,100.85 95.52,97.38 95.52,78.02 91.9,74.4 91.9,48.15 92.15,47.9 92.15,46.65 v91.65,46.15
  Bottom 0.2: U1.P43 v91.64,46.15 v91.65,46.15 | R44.RIGHT 102.15,126 v101.4,125.25
DEBUG_SW
  Bottom 0.2: U1.P57 98.46,38.74 98.9,38.3 R50.RIGHT
DIP_SW1  (via drill 0.35)
  Top 0.2: SW2.1 96.46,37.36 v98.4,39.3
  Bottom 0.2: U1.P54 98.4,40.24 | 98.4,40.24 99.76,40.24 R41.RIGHT | v98.4,39.3 98.4,40.24
DIP_SW2  (via drill 0.35)
  Top 0.2: SW2.2 101.54,42.04 v101,41.5
  Bottom 0.2: U1.P53 97.79,40.74 98.55,41.5 R31.RIGHT v101,41.5
DIP_SW3  (via drill 0.35)
  Top 0.2: SW2.4 100.5,34.67 100.5,42.45 v101,42.95
  Bottom 0.2: U1.P52 97.24,41.24 99,43 R30.RIGHT 100.05,42.95 v101,42.95 101,46.5 R25.RIGHT
DIP_SW4  (via drill 0.35)
  Top 0.2: SW2.8 v98.5,44.3
  Bottom 0.2: U1.P51 96.75,41.74 96.99,41.98 96.99,41.99 98.9,43.9 | 98.9,43.9 99.5,44.5 R29.RIGHT R26.RIGHT | v98.5,44.3 98.9,43.9
DIR1  (via drill 0.35)
  Route2 0.2: v87.03,39.35 87,39.38 87,43 81,49 70,49 61.45,57.55 61.45,78.03 59.94,79.54 36.81,79.54 26.65,89.7 24.24,89.7 EDGE1.P$26
  Bottom 0.2: U1.P24 86.42,38.74 v87.03,39.35
DIR2  (via drill 0.35)
  Route2 0.2: v85.75,45.8 79.95,51.6 71,51.6 63.35,59.25 63.35,82.35 61.05,84.65 41.5,84.65 39.75,86.4 39.75,91.2 EDGE2.P$26
  Bottom 0.2: U1.P25 85.34,39.24 85.75,39.65 v85.75,45.8
DIR3
  Bottom 0.2: U1.P26 83.89,39.74 83.55,39.4 79.58,39.4 78.85,40.13 78.85,45.67 79.68,46.5 82.36,46.5 82.85,46.98 82.85,54.99 78.87,58.97 78.87,65.53 77.66,66.74 67.4,66.74 63,71.14 63,87.6 60.91,89.69 58.25,89.69 EDGE3.P$26
DIR4
  Bottom 0.2: U1.P27 83.84,40.24 83.42,39.82 79.61,39.82 79.17,40.27 79.17,45.53 79.81,46.18 82.5,46.18 83.17,46.85 83.17,55.13 79.3,59 79.3,65.75 78.1,66.95 78.1,88.7 77.1,89.7 75.24,89.7 EDGE4.P$26
DISABLE  (via drill 0.35)
  Route2 0.2: v96.47,121.95 96.47,101.39 93.52,98.44 93.52,78.52 90.2,75.2 90.2,49.4 87.9,47.1 86.1,47.1 v82,51.2
  Bottom 0.152: U1.P20 84.59,36.78
  Bottom 0.2: 84.59,36.78 80.51,36.78 78.15,39.15 78.15,46.1 79.2,47.17 80.55,47.17 80.8,47.4 U22.IN 80.8,50.6 81.4,51.2 v82,51.2 | R90.RIGHT 100.46,121.96 v96.48,121.96 v96.47,121.95
E5V  (via drill 0.5)
  Top 0.2: R86.RIGHT 82,55 84.06,55 85.8,56.74 JP6.3
  Top 0.5: L1.R 84.3,74.92 84.87,74.35 88.34,74.35 89.55,75.56 89.55,76.41 90.41,77.27 91.71,77.27 91.71,77.28 92.61,78.17 v92.61,78.84
  Top 1.5: L1.R 82.6,75.7 C7.ANODE 82.6,63.4 86.7,59.3 JP6.3
  Bottom 0.45: U5.FB 91.71,76.97 91.71,78.51 92.04,78.84 v92.61,78.84
EMERGENCY  (via drill 0.35, 0.5)
  Top 0.2: U14.VCT 50.57,102.23 51,102.23 51.45,101.78 51.45,100.5 v51.6,100.5
  Top 0.5: v82.19,100.51 82.19,100.48 80.8,99.09 53.01,99.09 v51.6,100.5
  Bottom 0.2: v51.6,100.5 51.6,100.4 51,99.8 50.8,99.6 U18.IN
  Bottom 0.5: U21.OUT 86.95,100.7 86.05,99.8 83.85,99.8 83.16,100.49 82.2,100.49 v82.19,100.51 | R120.RIGHT 47.4,99.8 51,99.8
ENC1_A  (via drill 0.35)
  Route2 0.2: JP2.3 7,39 7,10.35 13.27,4.08 84.82,4.08 86.97,6.23 86.97,10.05 88.85,11.93 88.85,18.12 89.44,18.71 89.44,24.91 92.05,27.52 92.05,45 91.25,45.8 v90.65,45.8
  Bottom 0.2: v90.65,45.8 U1.P41
ENC1_B  (via drill 0.35)
  Route2 0.2: JP2.5 8,43.08 8,10.14 13.44,4.7 84.47,4.7 86.58,6.81 86.58,10.31 88.36,12.1 88.36,18.66 89.09,19.39 89.09,25.08 91.65,27.64 91.65,43.4 v91.35,43.7
  Bottom 0.2: v91.35,43.7 91.14,43.96 U1.P42
ENC2_A  (via drill 0.35)
  Route2 0.2: JP4.3 13.35,40.65 13.35,8.45 14.61,7.18 83.62,7.18 84.57,8.13 84.57,10.93 86.37,12.74 86.37,20.43 87.72,21.78 87.72,26.9 87.05,27.57 87.05,34.7 v86.4,35.35
  Bottom 0.2: v86.4,35.35 86.4,37.1 85.75,37.75 U1.P22
ENC2_B  (via drill 0.35)
  Route2 0.2: JP4.5 10.55,45.63 10.55,35.77 13.01,33.31 13.01,7.94 14.38,6.57 83.87,6.57 85.1,7.8 85.1,10.9 86.81,12.62 86.81,20 88.05,21.24 88.05,27.27 87.39,27.93 87.39,38.16 v87.26,38.29
  Bottom 0.2: U1.P23 84.69,38.29 v87.26,38.29
ENC3_A  (via drill 0.35)
  Route2 0.2: v98.85,37.81 104.18,32.48 104.18,19.18 87.68,2.68 13.02,2.68 5.6,10.1 5.6,23.4 JP3.3
  Bottom 0.2: U1.P58 98.42,38.24 v98.85,37.81
ENC3_B  (via drill 0.35)
  Route2 0.2: JP3.5 6.4,27.68 6.4,10.06 13.07,3.39 84.93,3.39 87.38,5.84 87.38,9.82 89.28,11.71 89.28,17.68 89.76,18.17 89.76,24.77 97.54,32.55 v97.54,37.75
  Bottom 0.2: v97.54,37.75 U1.P59
ENC4_A  (via drill 0.35)
  Route2 0.2: JP5.3 10.75,23.75 10.75,9.19 13.98,5.96 84.11,5.96 85.66,7.51 85.66,10.86 87.31,12.5 87.31,19.43 88.41,20.53 88.41,27.58 87.89,28.1 87.89,32.49 88.63,33.23 v88.63,46.7
  Bottom 0.2: U1.P37 v88.64,46.69 v88.63,46.7
ENC4_B  (via drill 0.35)
  Route2 0.2: JP5.5 9,27.08 9,10.13 13.83,5.3 84.21,5.3 86.12,7.21 86.12,10.54 87.81,12.23 87.81,18.98 88.75,19.92 88.75,25.54 89.06,25.85 89.06,29.1 88.22,29.94 88.22,32.13 89.15,33.06 v89.15,47.25
  Bottom 0.2: v89.15,47.25 U1.P38
IN1
  pour Bottom (no thermals): 13,25.2 27,25.2 27.85,26 27.85,58 27,59 18,59 17,58 17,51 16,50 13,50
IN2
  pour Bottom (no thermals): 44,25.2 33,25.2 31,27 31,30 29,32 29,58 30,59 44.85,59 44.85,26
IN3
  pour Bottom (no thermals): 52,25.2 50,25.2 48,27 48,30 46,32 46,58 47,59 61,59 61.85,58 61.85,26 61,25.2
IN4
  pour Bottom (no thermals): 78,59 64,59 63,58 63,32 65,30 65,28 67,25.2 78,25.2 78.55,25.72 78.55,58.35
IP1
  pour Bottom (no thermals): 13,24.8 13,13 14,12 23,12 24,13 24,16 25,17 27,17 27.85,18 27.85,24 27,24.8
IP2
  pour Bottom (no thermals): 31.2,24.8 31.2,13 32,12 41,12 42,13 42,17 44,17 44.85,18 44.85,24 44,24.8
IP3
  pour Bottom (no thermals): 48.2,24.8 48.2,13 49,12 59,12 60,13 60,14 60,16 61,17 61.85,18 61.85,24 61,24.8
IP4
  pour Bottom (no thermals): 65.2,24.8 65.2,13 66,12 77,12 78,13 78,16 78.85,17 78.85,24 78,24.8
MISO  (via drill 0.35)
  Route2 0.2: v40.84,104.59 47.62,97.84 77.37,97.84 81.53,93.68 81.53,68.67 83.5,66.7 83.5,51.89 v87.25,48.14
  Bottom 0.2: v40.84,104.59 v40.83,104.6 40.83,104.61 40.23,105.2 U2.SDO | v87.25,48.14 87.64,47.75 U1.P35
MOSI  (via drill 0.33, 0.35)
  Route2 0.2: v87.95,48.14 84.95,51.14 84.95,72.1 82.75,74.3 82.75,93.49 77.59,98.65 49.71,98.65 43.8,104.56 v42.11,104.56
  Bottom 0.2: v42.11,104.56 42.1,104.56 42.09,104.57 42.09,104.59 41.5,105.17 U2.SDI | v87.95,48.14 88.14,47.95 U1.P36
N$1  (via drill 0.35)
  Top 0.2: v29.7,26.05 29.4,26.05 28.5,25.15 R57.RIGHT
  Bottom 0.2: U4.VOUT 29.18,25.52 v29.7,26.05
N$2
  Bottom 0.2: TP2.RIGHT 15.65,97.65 R56.RIGHT
N$3
  Top 0.2: LED2.A 53.25,103.9 54.14,103.9 55.1,104.86 R5.RIGHT
N$4
  pour Route2 (no thermals): 32,44 24,44 21.5,46.5 17.5,46.5 16,45 16,19 17,18 19,18 21,16 21,14 23,12 32,12 33,13 33,43
N$5
  pour Route2 (no thermals): 38.5,46.5 35.5,46.5 34,45 34,19 35,18 37,18 39,16 39,14 41,12 49,12 50,13 50,43 49,44 41,44
N$6
  pour Route2 (no thermals): 51,45 51,19 52,18 55,18 57,16 57,14 59,12 67,12 68,13 68,43 67,44 58,44 55.5,46.5 52.5,46.5
N$7
  Top 0.2: LED8.A 18.35,102.35 R116.RIGHT
N$8
  Bottom 0.2: U15.EN/UVLO 89,63.6 R74.LEFT R75.RIGHT
N$9  (via drill 0.35)
  Route2 0.2: v79,131.49 73.96,126.45 20.45,126.45 8.92,114.92 JP8.2
  Bottom 0.2: U10.IN v79,131.49
N$10
  pour Route2 (no thermals): 69,45 69,19 70,18 73,18 75,16 75,14 77,12 85,12 86,13 86,43 85,44 75,44 73,46.5 70,46.5
  cutout Route2: 86.09,27.38 83.87,25.16 83.87,22.51 86.09,20.29
N$11
  Top 1.5: R3.1 48.6,33 | Q10.D 48.6,33 | 48.6,33 48.45,32.85 47.55,32.85 47.7,33 48.6,33 | 48.6,33 49.35,33
N$12
  Bottom 0.2: TLP1.VO 99,107.45 99.65,106.8 100.7,106.8 102.5,105 R77.LEFT
N$13
  Bottom 0.2: TP1.RIGHT 7.55,95.45 5,98 R54.RIGHT
N$14
  Bottom 0.2: R77.RIGHT TR3.B 100,100.9 R115.RIGHT
N$16  (via drill 0.35)
  Top 0.3: LED8.K 20.86,105.86 20.86,107.53 20.2,108.19 20.16,108.23 19.17,109.22 19.17,110.66 21.07,112.56 24.61,112.56 33.76,121.71 35.59,121.71 38.65,124.77 63.27,124.77 71.48,116.56 90.58,116.56 97.51,109.63 v97.51,104.36
  Bottom 0.2: U20.CATHODE v97.51,104.36 97.98,104.36 TR3.C
N$17
  Top 0.2: R2.RIGHT 57.35,103.35 LED1.A
N$18
  Bottom 0.2: U11.IN- 87.85,128 87.92,127.92 | 87.92,127.92 R60.RIGHT | R61.LEFT 88,128 87.92,127.92
N$19
  Top 1.5: INV_SW2.1 15.32,116 16,115.32 16,108.8 14.2,107 SW5.P 7.54,107 SW4.O 4.65,109.89 4.65,115.13 3.78,116 INV_SW1.2
N$20
  Bottom 0.5: R74.RIGHT 91.25,62.09 D3.C
  pour Bottom (no thermals): 88.45,55.45 85,55.45 85,52.95 90.36,52.95 90.36,59.35 88.55,59.35 88.55,61 91.72,61 91.72,62.55 88.5,62.55 88.5,63.2 87.1,63.2 87.1,57.7 88.45,57.7
N$21  (via drill 0.35)
  Top 0.2: SW4.P 6.04,105.96 14.43,105.96 14.48,106 19,106 LED3.K
  Route2 0.2: v102.03,93.73 CTRL1.1
  Bottom 0.2: TR3.E R115.LEFT 99.35,97.65 100.27,97.65 102.03,95.89 v102.03,93.73
  Bottom 1.5: CTRL1.1 THRU1.1 | CTRL2.1 THRU2.1 89.21,86.52 89.21,91.94 THRU1.1 | SW4.P 5.05,107 7.05,109 7.05,115.22 INV_SW1.1 10.77,120.5 15,120.5 16.5,122 16.5,124.84 14.54,126.8 11.93,126.8 9.86,128.87 9.86,133.18 12.67,135.99 54.18,135.99 61,129.17 61,102.67 63.61,100.06 80.86,100.06 82.27,98.65 86.08,98.65 THRU1.1
N$22  (via drill 0.35)
  Top 0.2: v48.95,78.75 49.15,78.55 U16.INB
  Bottom 0.2: U17.OUT 47.15,80.55 v48.95,78.75
N$23
  Bottom 0.2: R7.LEFT 23.54,109.3 SW1.R
N$24
  Top 0.2: R113.RIGHT 18.35,109.65 LED3.A
N$25
  Top 0.2: R79.LEFT 75.66,105 FUSE1.R1
  pour Route2 (no thermals): 72,116 72,102 74,100 93,100 95,102 95,115 95,116 93,118 74,118
N$26
  Top 0.2: Q6.G 39.76,103.79 44.13,103.79 Q1.G
  Top 0.25: U14.VGATE2 Q1.G
  Top 0.3: Q1.G 44.92,103 Q1.G
N$27
  Bottom 0.2: U$1.TXD 34.25,109 36.25,111 U2.TXCAN
N$28
  Bottom 0.2: U2.RXCAN 38.96,109.21 37,107.25 U$1.RXD
N$29
  Top 0.2: USB1.CC2 96.21,17.01 R8.RIGHT
N$30
  Top 0.2: USB1.CC1 96.3,14 R9.RIGHT
N$31
  Top 0.2: USB1.DP1 98.31,15.01 98.6,15.3 98.6,15.7 98.29,16.01 USB1.DP2 94.28,16.01 92.44,14.16 U3.UD+
N$32
  Top 0.2: U3.UD- 92.94,14.17 94.29,15.51 96.79,15.51 | USB1.DN1 96.79,15.51 | USB1.DN2 97.05,14.51 96.79,14.77 96.79,15.51
N$33  (via drill 0.35)
  Top 0.2: U3.TNOW 94.58,17.3 94.95,17.3 v95,17.25 | v97.1,22.61 97.89,22.61 R10.RIGHT
  Route2 0.2: v97.1,22.61 97.1,19.35 v95,17.25
N$34
  Top 0.2: LED4.A R10.LEFT
N$35
  Bottom 1: POW1.2 97.03,78.45 D1.A
N$36
  Bottom 0.5: U5.EN 91.24,75.55 92.44,75.55 R19.RIGHT R18.LEFT
N$37
  Bottom 1: POW.2 98.25,67.83 D2.A
N$38
  Bottom 0.2: U2.OSC2 42.77,112.86 R14.LEFT
N$39
  Bottom 0.2: U2.OSC1 44.04,109.96 47.73,106.28 C17.1 50.33,107.3 X1.1
N$40  (via drill 0.35)
  Top 1: L1.L 87.95,77.4 | L1.L 87.9,78.8 | L1.L 87.9,78.7 v89.35,80.15 v90.1,80.15 v90.85,80.15 v90.85,79.4
  Top 1.5: L1.L 87.9,77.5
  Bottom 1: C6.P$2 90.85,78.05 v90.85,79.4 v90.85,80.15 v90.1,80.15 v89.35,80.15
  pour Bottom (no thermals): 89.7,76 89.7,77.4 89.95,77.4 89.95,78.5 91.3,78.5 91.3,77 90.5,77 90.5,75.1 88.45,75.1 88.45,76
N$41
  Bottom 0.5: C6.P$1 88.99,77.59 U5.BST
N$42
  Bottom 0.2: X1.2 49.3,108.58 C16.1 49.25,109.33 45.14,113.44 R14.RIGHT
N$43
  Bottom 0.2: U7.IN- 87.85,133 R21.RIGHT R22.LEFT
N$44
  Bottom 0.2: U1.P16 86.64,31.61 83.82,28.8 83.82,22.33 84.65,21.5 R16.LEFT
N$45